# EAGLE design Uni-2.4(prot) (EAGLE 9.6.2)

## Sheet 1 of 4
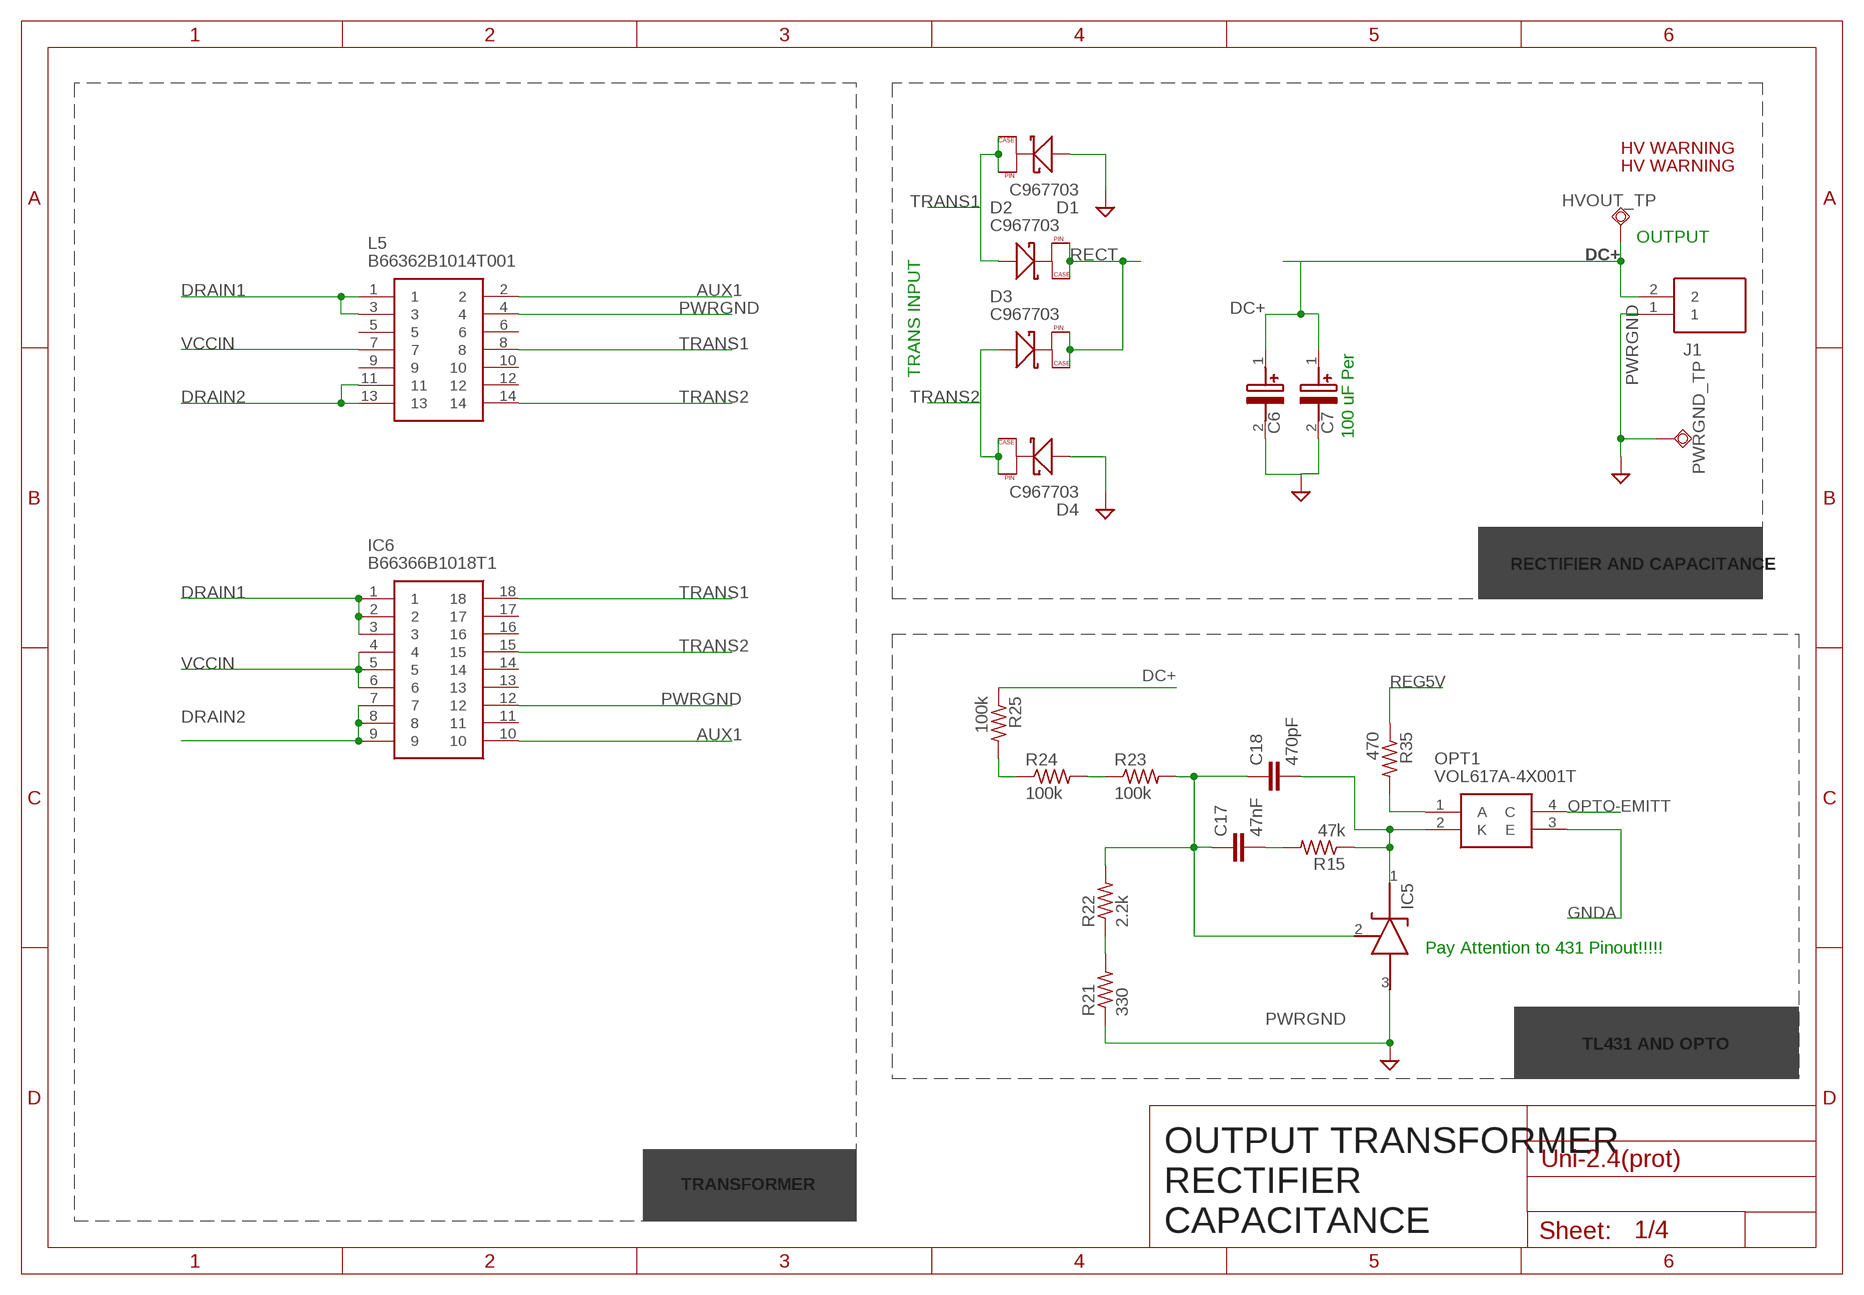
[diagram p0: schematic, sheet 1]

### Parts
C6  400BXW100MEFR18X25  [CAPPRD750W80D1825H2700]
C7  400BXW100MEFR18X25  [CAPPRD750W80D1825H2700]
C17  47nF  C-EUC0603K  [C0603K]
C18  470pF  C-EUC0603K  [C0603K]
D1  C967703  SICDIODE  [TO-252]
D2  C967703  SICDIODE  [TO-252]
D3  C967703  SICDIODE  [TO-252]
D4  C967703  SICDIODE  [TO-252]
HVOUT_TP  TPSQPAD1-13  [P1-13]
IC5  cl431  TL431CL3T  [SOT95P280X145-3N]
IC6  B66366B1018T1  [DIPS3556W80P508L4960H3840Q18N]
J1  TB005-762-02BE  [TB00576202BE]
L5  B66362B1014T001  [B66362B1014T001]
OPT1  VOL617A-4X001T  [SOP254P1015X230-4N]
PWRGND_TP  TPSQPAD1-13  [P1-13]
R15  47k  R-US_R0603  [R0603]
R21  330  R-US_R0805  [R0805]
R22  2.2k  R-US_R0805  [R0805]
R23  100k  R-US_R1206  [R1206]
R24  100k  R-US_R1206  [R1206]
R25  100k  R-US_R1206  [R1206]
R35  470  R-US_R0603  [R0603]
U$3  HV  [PSFBC_ELECTRIC_SHOCK]
U$4  HV  [PSFBC_ELECTRIC_SHOCK]

### Nets
AUX1: IC6.10 L5.2 ; also sheet 3
DC+: C6.1(+) C7.1(+) HVOUT_TP.TP J1.2 R25.1 ; also sheet 2
DRAIN1: IC6.1 IC6.2 IC6.3 L5.1 L5.3 ; also sheet 4
DRAIN2: IC6.7 IC6.8 IC6.9 L5.11 L5.13 ; also sheet 4
GNDA: OPT1.3(E) ; also sheet 3,4
N$1: R24.1 R25.2
N$3: C17.1 C18.1 IC5.2(REF) R22.2 R23.2
N$15: R23.1 R24.2
N$16: R21.2 R22.1
N$18: C18.2 IC5.1(CATHODE) OPT1.2(K) R15.1
N$19: OPT1.1(A) R35.2
N$21: C17.2 R15.2
OPTO-EMITT: OPT1.4(C) ; also sheet 4
PWRGND: C6.2(-) C7.2(-) D1.2(A) D4.2(A) IC5.3(ANODE) IC6.12 J1.1 L5.4 PWRGND_TP.TP R21.1 ; supply symbol labelled GND ; also sheet 2,3
RECT: D2.1(K_1) D2.3(K_2) D3.1(K_1) D3.3(K_2)
REG5V: R35.1 ; also sheet 3
TRANS1: D1.1(K_1) D1.3(K_2) D2.2(A) IC6.18 L5.8
TRANS2: D3.2(A) D4.1(K_1) D4.3(K_2) IC6.15 L5.14
VCCIN: IC6.4 IC6.5 IC6.6 L5.7 ; also sheet 3,4
Unconnected: IC6.11 IC6.13 IC6.14 IC6.16 IC6.17 L5.5 L5.6 L5.9 L5.10 L5.12

### Notes on the sheet
- OUTPUT
- TRANS INPUT
- 100 uF Per
- RECTIFIER AND CAPACITANCE
- Pay Attention to 431 Pinout!!!!!
- TL431 AND OPTO
- TRANSFORMER
- OUTPUT TRANSFORMER
  RECTIFIER
  CAPACITANCE

## Sheet 2 of 4
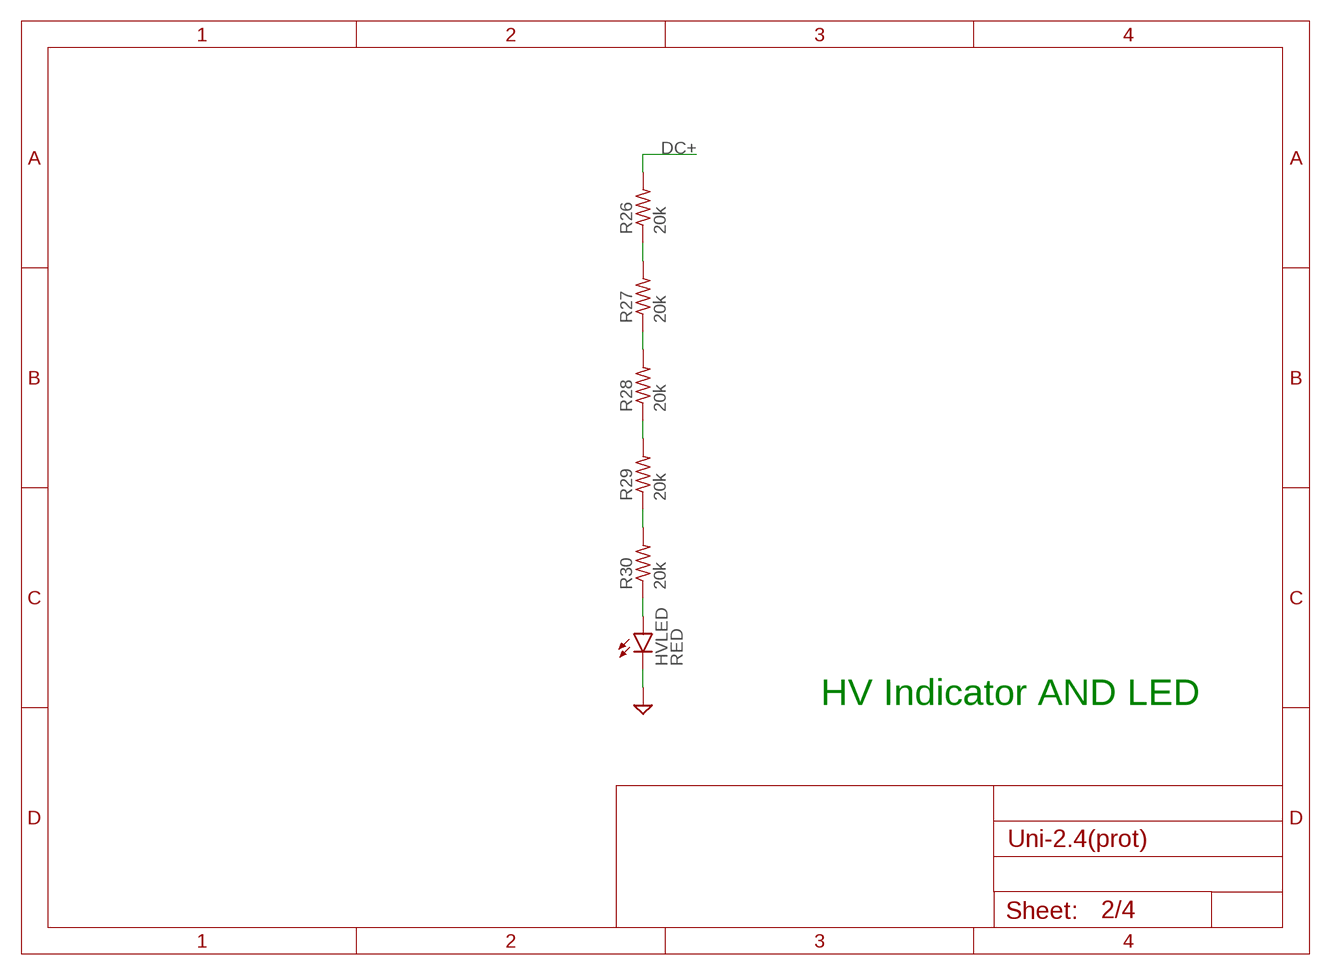
[diagram p1: schematic, sheet 2]

### Parts
HVLED  RED  LEDCHIPLED_0805  [CHIPLED_0805]
R26  20k  R-US_R1206  [R1206]
R27  20k  R-US_R1206  [R1206]
R28  20k  R-US_R1206  [R1206]
R29  20k  R-US_R1206  [R1206]
R30  20k  R-US_R1206  [R1206]

### Nets
DC+: R26.2 ; also sheet 1
N$12: HVLED.A R30.1
N$14: R29.1 R30.2
N$17: R28.1 R29.2
N$24: R27.1 R28.2
N$28: R26.1 R27.2
PWRGND: HVLED.C ; supply symbol labelled GND ; also sheet 1,3

### Notes on the sheet
- HV Indicator AND LED

## Sheet 3 of 4
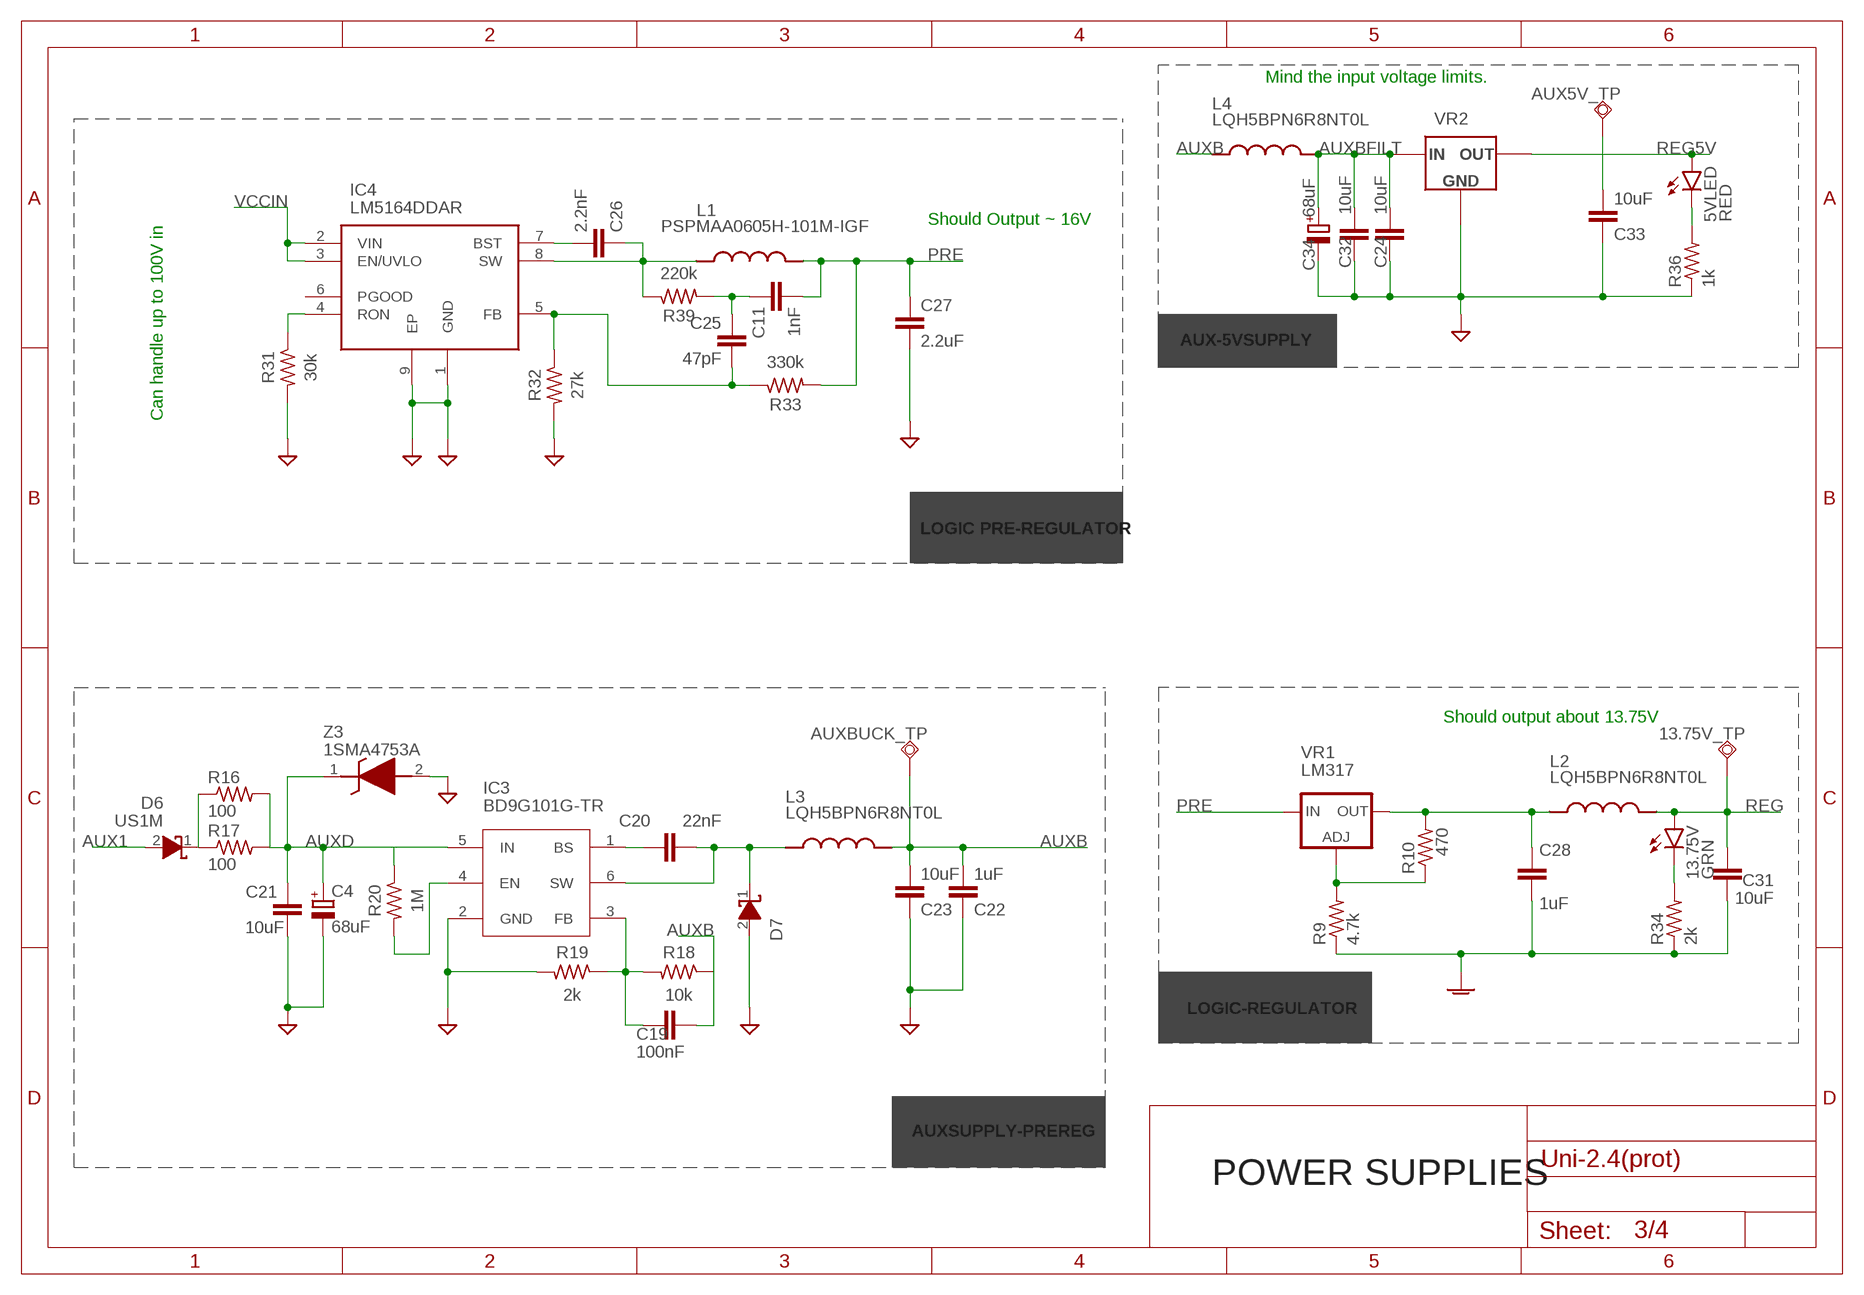
[diagram p2: schematic, sheet 3]

### Parts
5VLED  RED  LEDCHIPLED_0805  [CHIPLED_0805]
13.75V  GRN  LEDCHIPLED_0805  [CHIPLED_0805]
13.75V_TP  TPSQTP18R  [TP18R]
AUX5V_TP  TPSQPAD1-17  [P1-17]
AUXBUCK_TP  TPSQTP13R  [TP13R]
C4  68uF  CPOL-EUUD-8X10  [UD-8X10_NICHICON]
C11  1nF  C-EUC0402  [C0402]
C19  100nF  C-EUC0402K  [C0402K]
C20  22nF  C-EUC0603K  [C0603K]
C21  10uF  C-EUC0805K  [C0805K]
C22  1uF  C-EUC0402  [C0402]
C23  10uF  C-EUC0603K  [C0603K]
C24  10uF  C-EUC0603K  [C0603K]
C25  47pF  C-EUC0402  [C0402]
C26  2.2nF  C-EUC0402  [C0402]
C27  2.2uF  C-EUC0603K  [C0603K]
C28  1uF  C-EUC0603K  [C0603K]
C31  10uF  C-EUC0603K  [C0603K]
C32  10uF  C-EUC0603K  [C0603K]
C33  10uF  C-EUC0603K  [C0603K]
C34  68uF  CPOL-EUUD-8X10  [UD-8X10_NICHICON]
D6  US1M  SCHOTTKY  [DIOM5127X229N]
D7  SCHOTTKY  [DIOM5127X229N]
IC3  BD9G101G-TR  [SOT95P280X145-6N]
IC4  LM5164DDAR  [SOIC127P600X170-9N]
L1  PSPMAA0605H-101M-IGF  [PSPMAA0605H-101M-IGF]
L2  LQH5BPN6R8NT0L  [LQH5BPB100MT0L]
L3  LQH5BPN6R8NT0L  [LQH5BPB100MT0L]
L4  LQH5BPN6R8NT0L  [LQH5BPB100MT0L]
R9  4.7k  R-US_R0603  [R0603]
R10  470  R-US_R0603  [R0603]
R16  100  R-US_R1206  [R1206]
R17  100  R-US_R1206  [R1206]
R18  10k  R-US_R0402  [R0402]
R19  2k  R-US_R0402  [R0402]
R20  1M  R-US_R0402  [R0402]
R31  30k  R-US_R0402  [R0402]
R32  27k  R-US_R0603  [R0603]
R33  330k  R-US_R0402  [R0402]
R34  2k  R-US_R0603  [R0603]
R36  1k  R-US_R0603  [R0603]
R39  220k  R-US_R0603  [R0603]
VR1  LM317  LM317MBDT  [DPACK]
VR2  AP2120N-5.0TRG1  [SOT95P280X145-3N]
Z3  1SMA4753A  1SMA5942BT3G  [DIOM5226X220N]

### Nets
AUX1: D6.2(A) ; also sheet 1
AUXB: AUXBUCK_TP.TP C19.1 C22.2 C23.2 L3.2 L4.1 R18.1
AUXBFILT: C24.2 C32.2 C34.+ L4.2 VR2.3(VIN)
AUXD: C4.+ C21.1 IC3.5(IN) R16.2 R17.2 R20.1 Z3.1(K)
BS2: C20.1 IC3.1(BS)
EN2: IC3.4(EN) R20.2
FB2: C19.2 IC3.3(FB) R18.2 R19.1
GND: C27.2 IC4.1(GND) IC4.9(EP) R31.2 R32.2
GNDA: C28.2 C31.1 R9.1 R34.1 ; also sheet 1,4
N$10: R9.2 R10.1 VR1.1(ADJ)
N$11: IC4.4(RON) R31.1
N$22: 13.75V.C R34.2
N$25: C26.2 IC4.7(BST)
N$26: 5VLED.C R36.2
N$27: D6.1(K) R16.1 R17.1
N$29: C26.1 IC4.8(SW) L1.1 R39.1
N$30: C25.2 IC4.5(FB) R32.1 R33.1
N$31: C28.1 L2.1 R10.2 VR1.4(OUT)
N$32: C11.1 C25.1 R39.2
PRE: C11.2 C27.1 L1.2 R33.2 VR1.3(IN)
PWRGND: C4.- C21.2 C22.1 C23.1 C24.1 C32.1 C33.1 C34.- D7.2(A) IC3.2(GND) R19.2 R36.1 VR2.1(GND) Z3.2(A) ; supply symbol labelled GND ; also sheet 1,2
REG: 13.75V.A 13.75V_TP.TP C31.2 L2.2 ; also sheet 4
REG5V: 5VLED.A AUX5V_TP.TP C33.2 VR2.2(VOUT) ; also sheet 1
SWITCH2: C20.2 D7.1(K) IC3.6(SW) L3.1
VCCIN: IC4.2(VIN) IC4.3(EN/UVLO) ; also sheet 1,4
Unconnected: IC4.6(PGOOD)

### Notes on the sheet
- Mind the input voltage limits.
- Should Output ~ 16V
- AUX-5VSUPPLY
- Can handle up to 100V in
- LOGIC PRE-REGULATOR
- Should output about 13.75V
- LOGIC-REGULATOR
- AUXSUPPLY-PREREG
- POWER SUPPLIES

## Sheet 4 of 4
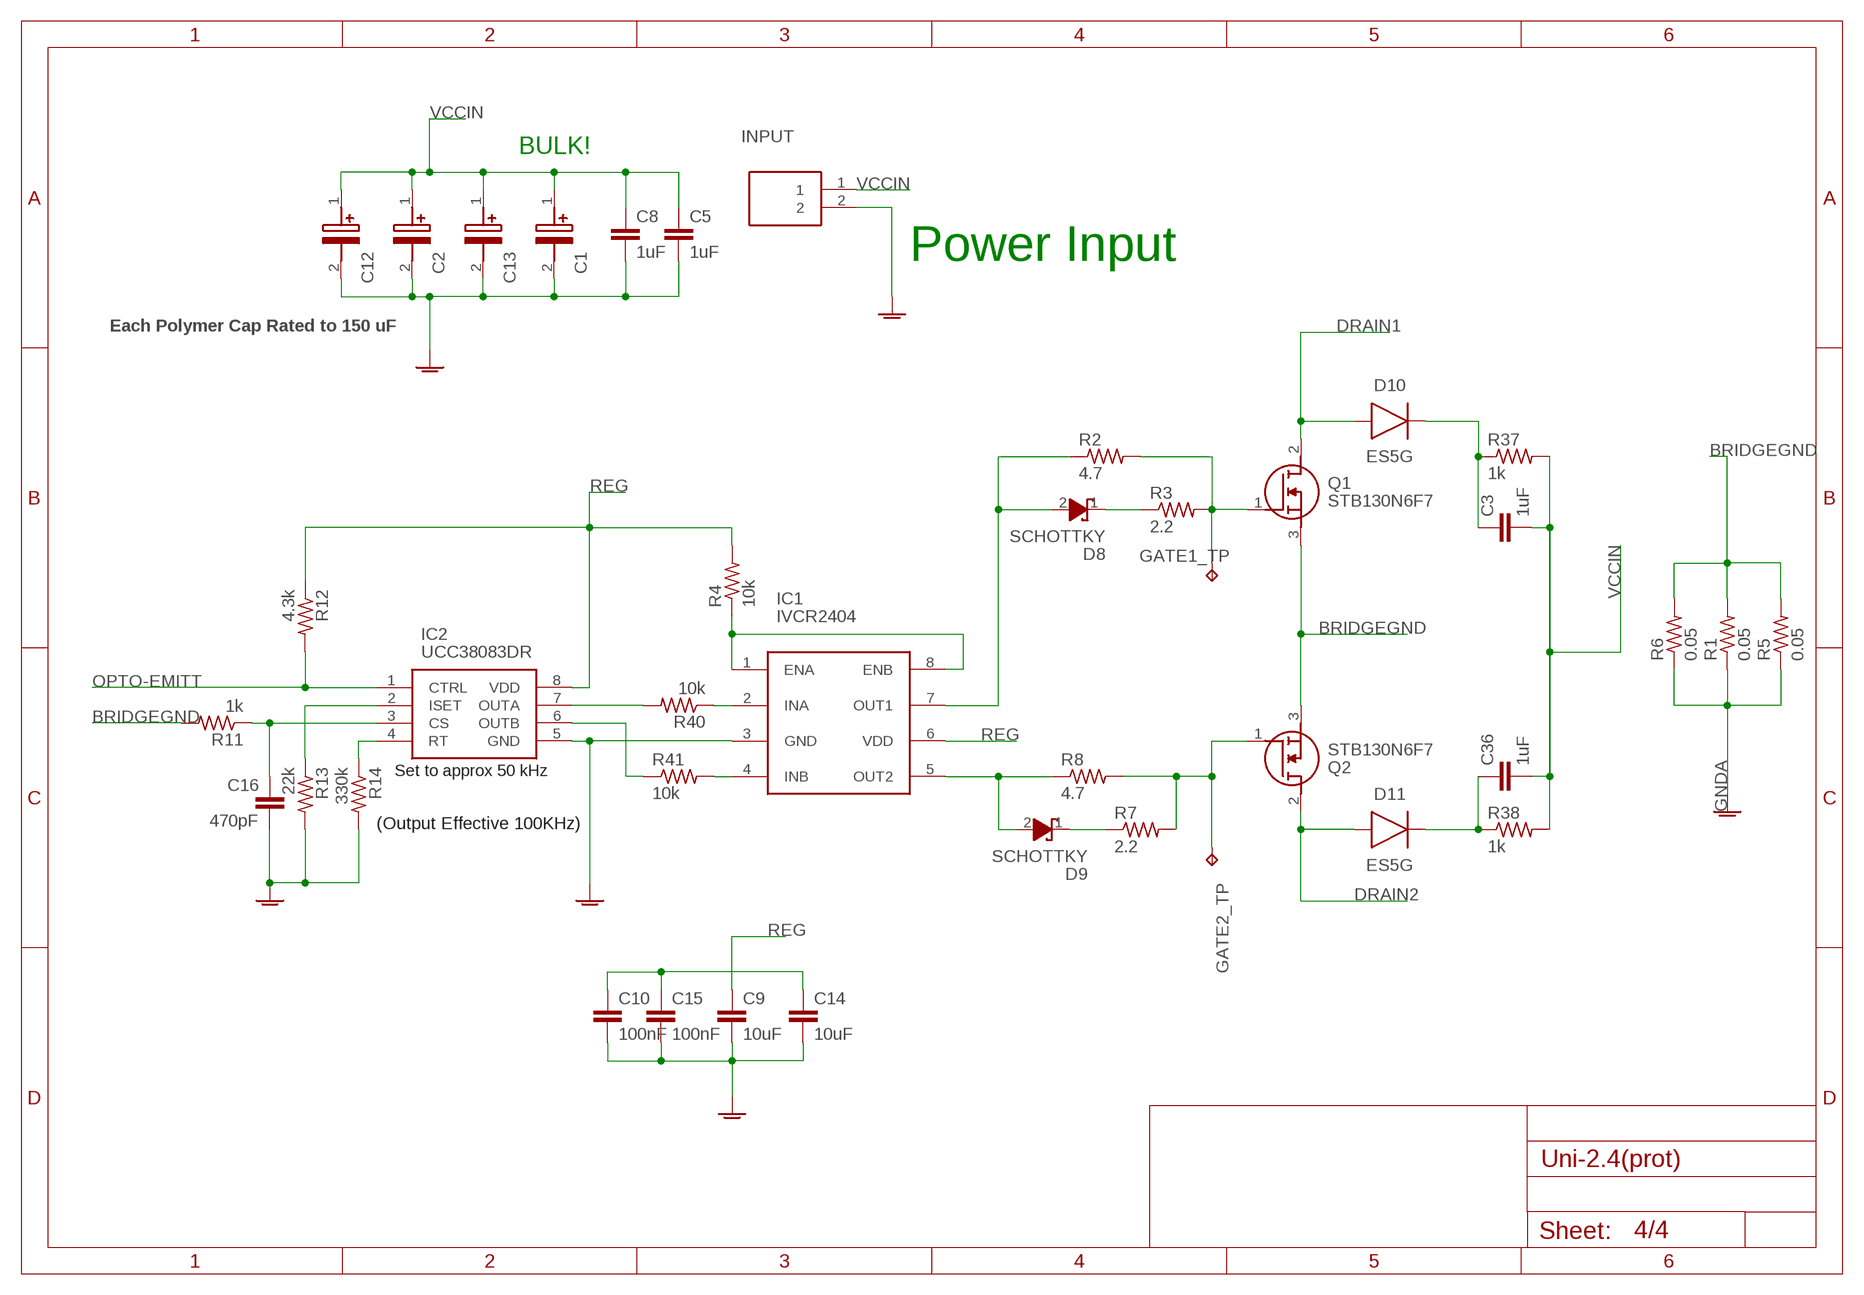
[diagram p3: schematic, sheet 4]

### Parts
C1  OVK151M1VTR-10131  [16SVF1000M]
C2  OVK151M1VTR-10131  [16SVF1000M]
C3  1uF  C-EUC1206K  [C1206K]
C5  1uF  C-EUC0805K  [C0805K]
C8  1uF  C-EUC0805K  [C0805K]
C9  10uF  C-EUC0603K  [C0603K]
C10  100nF  C-EUC0603K  [C0603K]
C12  OVK151M1VTR-10131  [16SVF1000M]
C13  OVK151M1VTR-10131  [16SVF1000M]
C14  10uF  C-EUC0603K  [C0603K]
C15  100nF  C-EUC0603K  [C0603K]
C16  470pF  C-EUC0603K  [C0603K]
C36  1uF  C-EUC1206K  [C1206K]
D8  SCHOTTKY  [DIOM5127X229N]
D9  SCHOTTKY  [DIOM5127X229N]
D10  ES5G  DIODEDO-214AA(SMB)  [DIOM5336X265N]
D11  ES5G  DIODEDO-214AA(SMB)  [DIOM5336X265N]
GATE1_TP  TPTP13R  [TP13R]
GATE2_TP  TPTP13R  [TP13R]
IC1  IVCR2404  MCP14A0304T-E_SN  [SOIC127P600X175-8N]
IC2  UCC38083DR  [SOIC127P600X175-8N]
INPUT  TB005-762-02BE  [TB00576202BE]
Q1  STB130N6F7  [D2PAK]
Q2  STB130N6F7  [D2PAK]
R1  0.05  R-US_R2512  [R2512]
R2  4.7  R-US_R0805  [R0805]
R3  2.2  R-US_R0805  [R0805]
R4  10k  R-US_R0402  [R0402]
R5  0.05  R-US_R2512  [R2512]
R6  0.05  R-US_R2512  [R2512]
R7  2.2  R-US_R0805  [R0805]
R8  4.7  R-US_R0805  [R0805]
R11  1k  R-US_R0603  [R0603]
R12  4.3k  R-US_R0603  [R0603]
R13  22k  R-US_R0603  [R0603]
R14  330k  R-US_R0603  [R0603]
R37  1k  R-US_R2512  [R2512]
R38  1k  R-US_R2512  [R2512]
R40  10k  R-US_R0402  [R0402]
R41  10k  R-US_R0402  [R0402]

### Nets
BRIDGEGND: Q1.3(S) Q2.3(S) R1.2 R5.2 R6.2 R11.2
CS-IN: C16.1 IC2.3(CS) R11.1
DRAIN1: D10.2(A) Q1.2(D) ; also sheet 1
DRAIN2: D11.2(A) Q2.2(D) ; also sheet 1
GNDA: C1.2(-) C2.2(-) C5.2 C8.2 C9.2 C10.2 C12.2(-) C13.2(-) C14.2 C15.2 C16.2 IC1.3(GND) IC2.5(GND) INPUT.2 R1.1 R5.1 R6.1 R13.2 R14.2 ; also sheet 1,3
N$2: IC1.2(INA) R40.1
N$4: D8.1(K) R3.1
N$5: IC1.4(INB) R41.2
N$6: IC1.1(ENA) IC1.8(ENB) R4.1
N$7: D8.2(A) IC1.7(OUT1) R2.1
N$8: D9.2(A) IC1.5(OUT2) R8.1
N$9: D9.1(K) R7.1
N$13: IC2.2(ISET) R13.1
N$20: C3.1 D10.1(C) R37.1
N$23: C36.1 D11.1(C) R38.1
N$33: IC2.6(OUTB) R41.1
N$34: IC2.7(OUTA) R40.2
OPTO-EMITT: IC2.1(CTRL) R12.2 ; also sheet 1
Q1G: GATE1_TP.TP Q1.1(G) R2.2 R3.2
Q2G: GATE2_TP.TP Q2.1(G) R7.2 R8.2
REG: C9.1 C10.1 C14.1 C15.1 IC1.6(VDD) IC2.8(VDD) R4.2 R12.1 ; also sheet 3
RT: IC2.4(RT) R14.1
VCCIN: C1.1(+) C2.1(+) C3.2 C5.1 C8.1 C12.1(+) C13.1(+) C36.2 INPUT.1 R37.2 R38.2 ; also sheet 1,3

### Notes on the sheet
- BULK!
- Power Input
- Each Polymer Cap Rated to 150 uF
- Set to approx 50 kHz
- (Output Effective 100KHz)

## Library data of the parts
5VLED 13.75V = led:LED: LED OSRAM: - CHIPLED LG R971, LG N971, LY N971, LG Q971, LY Q971, LO R971, LY R971 LH N974, LH R974 LS Q976, LO Q976, LY Q976 LO Q996 - Hyper CHIPLED LW Q18S LB Q993, LB Q99A, LB R99A - SideLED LS A670, LO A670, LY A670, LG A670, LP A670 LB A673, LV A673, LT A673, LW A673 LH A674 LY A675 LS A676, LA A676, LO A676, LY A676, LW A676 LS A679, LY A679, LG A679 - Hyper Micro SIDELED® LS Y876, LA Y876, LO Y876, LY Y876 LT Y87S - SmartLED LW L88C, LW L88S LB L89C, LB L89S, LG L890 LS L89K, LO L89K, LY L89K LS L896, LA L896, LO L896, LY L896 - TOPLED LS T670, LO T670, LY T670, LG T670, LP T670 LSG T670, LSP T670, LSY T670, LOP T670, LYG T670 LG T671, LOG T671, LSG T671 LB T673, LV T673, LT T673, LW T673 LH T674 LS T676, LA T676, LO T676, LY T676, LB T676, LH T676, LSB T676, LW T676 LB T67C, LV T67C, LT T67C, LS T67K, LO T67K, LY T67K, LW E67C LS E67B, LA E67B, LO E67B, LY E67B, LB E67C, LV E67C, LT E67C LW T67C LS T679, LY T679, LG T679 LS T770, LO T770, LY T770, LG T770, LP T770 LB T773, LV T773, LT T773, LW T773 LH T774 LS E675, LA E675, LY E675, LS T675 LS T776, LA T776, LO T776, LY T776, LB T776 LHGB T686 LT T68C, LB T68C - Hyper Mini TOPLED® LB M676 - Mini TOPLED Santana® LG M470 LS M47K, LO M47K, LY M47K Source: http://www.osram.convergy.de LUXEON: - LUMILED® LXK2-PW12-R00, LXK2-PW12-S00, LXK2-PW14-U00, LXK2-PW14-V00 LXK2-PM12-R00, LXK2-PM12-S00, LXK2-PM14-U00 LXK2-PE12-Q00, LXK2-PE12-R00, LXK2-PE12-S00, LXK2-PE14-T00, LXK2-PE14-U00 LXK2-PB12-K00, LXK2-PB12-L00, LXK2-PB12-M00, LXK2-PB14-N00, LXK2-PB14-P00, LXK2-PB14-Q00 LXK2-PR12-L00, LXK2-PR12-M00, LXK2-PR14-Q00, LXK2-PR14-R00 LXK2-PD12-Q00, LXK2-PD12-R00, LXK2-PD12-S00 LXK2-PH12-R00, LXK2-PH12-S00 LXK2-PL12-P00, LXK2-PL12-Q00, LXK2-PL12-R00 Source: www.luxeon.com KINGBRIGHT: KA-3528ASYC Source: www.kingbright.com; LCSC_PART: C72043
13.75V_TP AUX5V_TP AUXBUCK_TP HVOUT_TP PWRGND_TP = testpad:TPSQ: Test pad
C1 C2 C12 C13 = SamacSys_Parts:OVK151M1VTR-1013: OVK151M1VTR-1013
C3 C17 C18 C21 C33 C36 = rcl:C-EU: CAPACITOR, European symbol; SPICEPREFIX: C
C4 C34 = rcl:CPOL-EU: POLARIZED CAPACITOR, European symbol; LCSC_PART: C249948; SPICEPREFIX: C
C5 C8-C11 C14 C15 C22-C27 C32 = rcl:C-EU: CAPACITOR, European symbol; LCSC_PART: C440198; SPICEPREFIX: C
C6 C7 = SamacSys_Parts:400BXW100MEFR18X25: Aluminum Electrolytic Capacitors - Radial Leaded LONG LIFE ELECTROLYTIC CAPACITORS Source: Datasheet <http://www.rubycon.co.jp/en/catalog/e_pdfs/aluminum/e_BXW.pdf>; DESCRIPTION: Aluminum Electrolytic Capacitors - Radial Leaded LONG LIFE ELECTROLYTIC CAPACITORS; HEIGHT: 27mm; MANUFACTURER_NAME: Rubycon; MANUFACTURER_PART_NUMBER: 400BXW100MEFR18X25
C16 = rcl:C-EU: CAPACITOR, European symbol; LCSC_PART: C1620; SPICEPREFIX: C
C19 = rcl:C-EU: CAPACITOR, European symbol; LCSC_PART: C1546; SPICEPREFIX: C
C20 = rcl:C-EU: CAPACITOR, European symbol; LCSC_PART: C14663; SPICEPREFIX: C
C28 C31 = rcl:C-EU: CAPACITOR, European symbol; LCSC_PART: C440198
D1-D4 = SamacSys_Parts:SICDIODE: SiC TO-252 Diode
D6 D8 D9 = SamacSys_Parts:SCHOTTKY: Schottky Diodes & Rectifiers 60V Sctky Bar Rectfr SMA (DO-214AC) Source: Datasheet <https://www.arrow.com/en/products/ss16he3-bh/vishay>; DESCRIPTION: Schottky Diodes & Rectifiers 60V Sctky Bar Rectfr SMA (DO-214AC); HEIGHT: 2.29mm; MANUFACTURER_NAME: Vishay; MANUFACTURER_PART_NUMBER: SS16HE3_B/H; MOUSER_PART_NUMBER: 78-SS16HE3_B/H; MOUSER_PRICE-STOCK: https://www.mouser.co.uk/ProductDetail/Vishay-General-Semiconductor/SS16HE3_B-H?qs=MLItCLRbWsyJmaJ87KUvIw%3D%3D
D7 = SamacSys_Parts:SCHOTTKY: Schottky Diodes & Rectifiers 60V Sctky Bar Rectfr SMA (DO-214AC) Source: Datasheet <https://www.arrow.com/en/products/ss16he3-bh/vishay>; DESCRIPTION: Schottky Diodes & Rectifiers 60V Sctky Bar Rectfr SMA (DO-214AC); HEIGHT: 2.29mm; LCSC_PART: C22452; MANUFACTURER_NAME: Vishay; MANUFACTURER_PART_NUMBER: SS16HE3_B/H; MOUSER_PART_NUMBER: 78-SS16HE3_B/H; MOUSER_PRICE-STOCK: https://www.mouser.co.uk/ProductDetail/Vishay-General-Semiconductor/SS16HE3_B-H?qs=MLItCLRbWsyJmaJ87KUvIw%3D%3D
D10 = Diode:DIODE: Diode Rectifier - Generic; CATEGORY: Diode; LCSC_PART: C128705; SUB-CATEGORY: Rectifier; VALUE: DIODE
D11 = Diode:DIODE: Diode Rectifier - Generic; CATEGORY: Diode; SUB-CATEGORY: Rectifier; VALUE: DIODE
GATE1_TP GATE2_TP = testpad:TP: Test pad
HVLED = led:LED: LED OSRAM: - CHIPLED LG R971, LG N971, LY N971, LG Q971, LY Q971, LO R971, LY R971 LH N974, LH R974 LS Q976, LO Q976, LY Q976 LO Q996 - Hyper CHIPLED LW Q18S LB Q993, LB Q99A, LB R99A - SideLED LS A670, LO A670, LY A670, LG A670, LP A670 LB A673, LV A673, LT A673, LW A673 LH A674 LY A675 LS A676, LA A676, LO A676, LY A676, LW A676 LS A679, LY A679, LG A679 - Hyper Micro SIDELED® LS Y876, LA Y876, LO Y876, LY Y876 LT Y87S - SmartLED LW L88C, LW L88S LB L89C, LB L89S, LG L890 LS L89K, LO L89K, LY L89K LS L896, LA L896, LO L896, LY L896 - TOPLED LS T670, LO T670, LY T670, LG T670, LP T670 LSG T670, LSP T670, LSY T670, LOP T670, LYG T670 LG T671, LOG T671, LSG T671 LB T673, LV T673, LT T673, LW T673 LH T674 LS T676, LA T676, LO T676, LY T676, LB T676, LH T676, LSB T676, LW T676 LB T67C, LV T67C, LT T67C, LS T67K, LO T67K, LY T67K, LW E67C LS E67B, LA E67B, LO E67B, LY E67B, LB E67C, LV E67C, LT E67C LW T67C LS T679, LY T679, LG T679 LS T770, LO T770, LY T770, LG T770, LP T770 LB T773, LV T773, LT T773, LW T773 LH T774 LS E675, LA E675, LY E675, LS T675 LS T776, LA T776, LO T776, LY T776, LB T776 LHGB T686 LT T68C, LB T68C - Hyper Mini TOPLED® LB M676 - Mini TOPLED Santana® LG M470 LS M47K, LO M47K, LY M47K Source: http://www.osram.convergy.de LUXEON: - LUMILED® LXK2-PW12-R00, LXK2-PW12-S00, LXK2-PW14-U00, LXK2-PW14-V00 LXK2-PM12-R00, LXK2-PM12-S00, LXK2-PM14-U00 LXK2-PE12-Q00, LXK2-PE12-R00, LXK2-PE12-S00, LXK2-PE14-T00, LXK2-PE14-U00 LXK2-PB12-K00, LXK2-PB12-L00, LXK2-PB12-M00, LXK2-PB14-N00, LXK2-PB14-P00, LXK2-PB14-Q00 LXK2-PR12-L00, LXK2-PR12-M00, LXK2-PR14-Q00, LXK2-PR14-R00 LXK2-PD12-Q00, LXK2-PD12-R00, LXK2-PD12-S00 LXK2-PH12-R00, LXK2-PH12-S00 LXK2-PL12-P00, LXK2-PL12-Q00, LXK2-PL12-R00 Source: www.luxeon.com KINGBRIGHT: KA-3528ASYC Source: www.kingbright.com
IC1 = SamacSys_Parts:MCP14A0304T-E_SN: Microchip Technology MCP14A0304T-E/SN Dual Low Side MOSFET Power Driver, 3A 8-Pin, SOIC Source: Datasheet <http://www.microchip.com/mymicrochip/filehandler.aspx?ddocname=en606629>; DESCRIPTION: Microchip Technology MCP14A0304T-E/SN Dual Low Side MOSFET Power Driver, 3A 8-Pin, SOIC; HEIGHT: 1.75mm; LCSC_PART: C2924635; MANUFACTURER_NAME: Microchip; MANUFACTURER_PART_NUMBER: MCP14A0304T-E/SN; MOUSER_PART_NUMBER: 579-MCP14A0304T-E/SN; MOUSER_PRICE-STOCK: https://www.mouser.co.uk/ProductDetail/Microchip-Technology/MCP14A0304T-E-SN?qs=w%2Fv1CP2dgqqqWUCaoFqV0w%3D%3D
IC2 = SamacSys_Parts:UCC38083DR: Current Mode Push-Pull PWM With Programmable Slope Compensation Source: Datasheet <http://www.ti.com/lit/gpn/ucc38083>; DESCRIPTION: Current Mode Push-Pull PWM With Programmable Slope Compensation; HEIGHT: 1.75mm; MANUFACTURER_NAME: Texas Instruments; MANUFACTURER_PART_NUMBER: UCC38083DR; MOUSER_PART_NUMBER: 595-UCC38083DR; MOUSER_PRICE-STOCK: https://www.mouser.co.uk/ProductDetail/Texas-Instruments/UCC38083DR/?qs=zqbRmZ%252BfZD9Rvt3ie7yhvg%3D%3D
IC3 = SamacSys_Parts:BD9G101G-TR: Has FB voltage of 0.75V! Operates at 1.5 MHz. No PFM.; LCSC_PART: C97643
IC4 = SamacSys_Parts:LM5164DDAR: Texas Instruments 6-V to 100-V Input, 1-A Synchronous Buck DC-DC Converter With Ultra-Low IQ 8-SO PowerPAD -40 to 150 Source: Datasheet <http://www.ti.com/lit/ds/symlink/lm5164.pdf>; DESCRIPTION: Texas Instruments 6-V to 100-V Input, 1-A Synchronous Buck DC-DC Converter With Ultra-Low IQ 8-SO PowerPAD -40 to 150; HEIGHT: 1.7mm; MANUFACTURER_NAME: Texas Instruments; MANUFACTURER_PART_NUMBER: LM5164DDAR; MOUSER_PART_NUMBER: 595-LM5164DDAR; MOUSER_PRICE-STOCK: https://www.mouser.co.uk/ProductDetail/Texas-Instruments/LM5164DDAR?qs=PqoDHHvF64%2F0M%252BK9zcb2mw%3D%3D
IC5 = SamacSys_Parts:TL431CL3T: Adjustable micropower shunt voltage reference Source: Datasheet <https://www.st.com/resource/en/datasheet/tl431.pdf>; DESCRIPTION: Adjustable micropower shunt voltage reference; HEIGHT: 1.12mm; MANUFACTURER_NAME: STMicroelectronics; MANUFACTURER_PART_NUMBER: TL431CL3T; MOUSER_PART_NUMBER: 511-TL431CL3T; MOUSER_PRICE-STOCK: https://www.mouser.co.uk/ProductDetail/STMicroelectronics/TL431CL3T?qs=L6eUzyzWLAsU2SYO1NdhdA%3D%3D
IC6 = SamacSys_Parts:B66366B1018T1: Ferrite Cores & Accessories COIL FORMER VALOX 420 SEO Source: Datasheet <https://componentsearchengine.com/Datasheets/1/B66366B1018T1.pdf>; DESCRIPTION: Ferrite Cores & Accessories COIL FORMER VALOX 420 SEO; HEIGHT: 38.4mm; MANUFACTURER_NAME: TDK; MANUFACTURER_PART_NUMBER: B66366B1018T1; MOUSER_PART_NUMBER: 871-B66366B1018T1; MOUSER_PRICE-STOCK: https://www.mouser.co.uk/ProductDetail/EPCOS-TDK/B66366B1018T1?qs=fWY6Jreybtk%2F8sjb6uin%252BA%3D%3D
INPUT J1 = SamacSys_Parts:TB005-762-02BE: Fixed Terminal Blocks screw type, 7.62 , horizontal, 2 poles, CUI Blue, slotted screw, PCB mount Source: Datasheet <https://componentsearchengine.com/Datasheets/1/TB005-762-02BE.pdf>; DESCRIPTION: Fixed Terminal Blocks screw type, 7.62 , horizontal, 2 poles, CUI Blue, slotted screw, PCB mount; HEIGHT: 21.7mm; MANUFACTURER_NAME: CUI Inc.; MANUFACTURER_PART_NUMBER: TB005-762-02BE; MOUSER_PART_NUMBER: 490-TB005-762-02BE; MOUSER_PRICE-STOCK: https://www.mouser.co.uk/ProductDetail/CUI-Devices/TB005-762-02BE?qs=vLWxofP3U2zXv1H2wuShow%3D%3D
L1 = SamacSys_Parts:PSPMAA0605H-101M-IGF; LCSC_PART: C2983096
L2-L4 = SamacSys_Parts:LQH5BPN6R8NT0L: MURATA - LQH5BPN6R8NT0L - INDUCTOR, 6.8UH, +/-30%, POWER Source: Datasheet <https://psearch.en.murata.com/inductor/product/LQH5BPN6R8NT0#.html>; DESCRIPTION: MURATA - LQH5BPN6R8NT0L - INDUCTOR, 6.8UH, +/-30%, POWER; HEIGHT: 2.2mm; MANUFACTURER_NAME: Murata Electronics; MANUFACTURER_PART_NUMBER: LQH5BPN6R8NT0L; MOUSER_PART_NUMBER: 81-LQH5BPN6R8NT0L0L; MOUSER_PRICE-STOCK: https://www.mouser.co.uk/ProductDetail/Murata-Electronics/LQH5BPN6R8NT0L?qs=3ZwS9AhGA%2F4N8axqd87eRQ%3D%3D
L5 = SamacSys_Parts:B66362B1014T001: Ferrite Accessories, E Cores Accessories(EFD/ER/ETD), Coil former (ETD 34/17/11) Source: Datasheet <https://product.tdk.com/system/files/dam/doc/product/ferrite/ferrite/ferrite-acc/data_sheet/80/db/fer/etd_34_17_11.pdf>; DESCRIPTION: Ferrite Accessories, E Cores Accessories(EFD/ER/ETD), Coil former (ETD 34/17/11); HEIGHT: 33.1mm; MANUFACTURER_NAME: TDK; MANUFACTURER_PART_NUMBER: B66362B1014T001; MOUSER_PART_NUMBER: 871-B66362B1014T001; MOUSER_PRICE-STOCK: https://www.mouser.co.uk/ProductDetail/EPCOS-TDK/B66362B1014T001?qs=w5o0Loj0u7M9FVK%2Ff7P38g%3D%3D
OPT1 = SamacSys_Parts:VOL617A-4X001T: Vishay VOL617A-4X001T DC Input Phototransistor Output Optocoupler, Surface Mount, 4-Pin LSOP Source: Datasheet <https://www.vishay.com/docs/82424/vol617a.pdf>; DESCRIPTION: Vishay VOL617A-4X001T DC Input Phototransistor Output Optocoupler, Surface Mount, 4-Pin LSOP; HEIGHT: 2.3mm; MANUFACTURER_NAME: Vishay; MANUFACTURER_PART_NUMBER: VOL617A-4X001T; MOUSER_PART_NUMBER: 78-VOL617A-4X001T; MOUSER_PRICE-STOCK: https://www.mouser.co.uk/ProductDetail/Vishay-Semiconductors/VOL617A-4X001T?qs=s4XK1XdnRilEoTFGQUoymA%3D%3D
Q1 Q2 = SamacSys_Parts:STB130N6F7
R1-R8 R15-R17 R21-R30 R35 R37 R38 = rcl:R-US_: RESISTOR, American symbol; SPICEPREFIX: R
R9 R10 R12 R34 R36 = rcl:R-US_: RESISTOR, American symbol; LCSC_PART: C22975; SPICEPREFIX: R
R11 R40 R41 = rcl:R-US_: RESISTOR, American symbol; LCSC_PART: C21190; SPICEPREFIX: R
R13 = rcl:R-US_: RESISTOR, American symbol; LCSC_PART: C31850; SPICEPREFIX: R
R14 = rcl:R-US_: RESISTOR, American symbol; LCSC_PART: C25811; SPICEPREFIX: R
R18 R19 = rcl:R-US_: RESISTOR, American symbol; LCSC_PART: C25779; SPICEPREFIX: R
R20 R31-R33 R39 = rcl:R-US_: RESISTOR, American symbol; LCSC_PART: C25741; SPICEPREFIX: R
U$3 U$4 = RMP - HALF BRIDGE 0.0.1:HV
VR1 = v-reg:LM317?*: 500 mA Adjustable Output Positive Voltage Regulator Source: http://www.onsemi.co.jp .. LM317M-D.PDF
VR2 = SamacSys_Parts:AP2120N-5.0TRG1: IC REG LINEAR 5V 150MA SOT23 Source: Datasheet; DESCRIPTION: IC REG LINEAR 5V 150MA SOT23; HEIGHT: 1.2mm; MANUFACTURER_NAME: Diodes Inc.; MANUFACTURER_PART_NUMBER: AP2120N-5.0TRG1; MOUSER_PART_NUMBER: 621-AP2120N-5.0TRG1; MOUSER_PRICE-STOCK: https://www.mouser.co.uk/ProductDetail/Diodes-Incorporated/AP2120N-50TRG1?qs=M%2FOdCRO8QQ3JQu49DdtyIA%3D%3D
Z3 = SamacSys_Parts:1SMA5942BT3G: ON Semiconductor 1SMA5942BT3G Zener Diode, 51V 5% 1.5 W SMT 2-Pin SMA Source: Datasheet <http://www.onsemi.com/pub/Collateral/1SMA5913BT3-D.PDF>; DESCRIPTION: ON Semiconductor 1SMA5942BT3G Zener Diode, 51V 5% 1.5 W SMT 2-Pin SMA; HEIGHT: 2.2mm; LCSC_PART: C362284; MANUFACTURER_NAME: onsemi; MANUFACTURER_PART_NUMBER: 1SMA5942BT3G; MOUSER_PART_NUMBER: 863-1SMA5942BT3G; MOUSER_PRICE-STOCK: https://www.mouser.co.uk/ProductDetail/ON-Semiconductor/1SMA5942BT3G?qs=y2kkmE52mdPrQGqg%252Bfz9yg%3D%3D

## Board
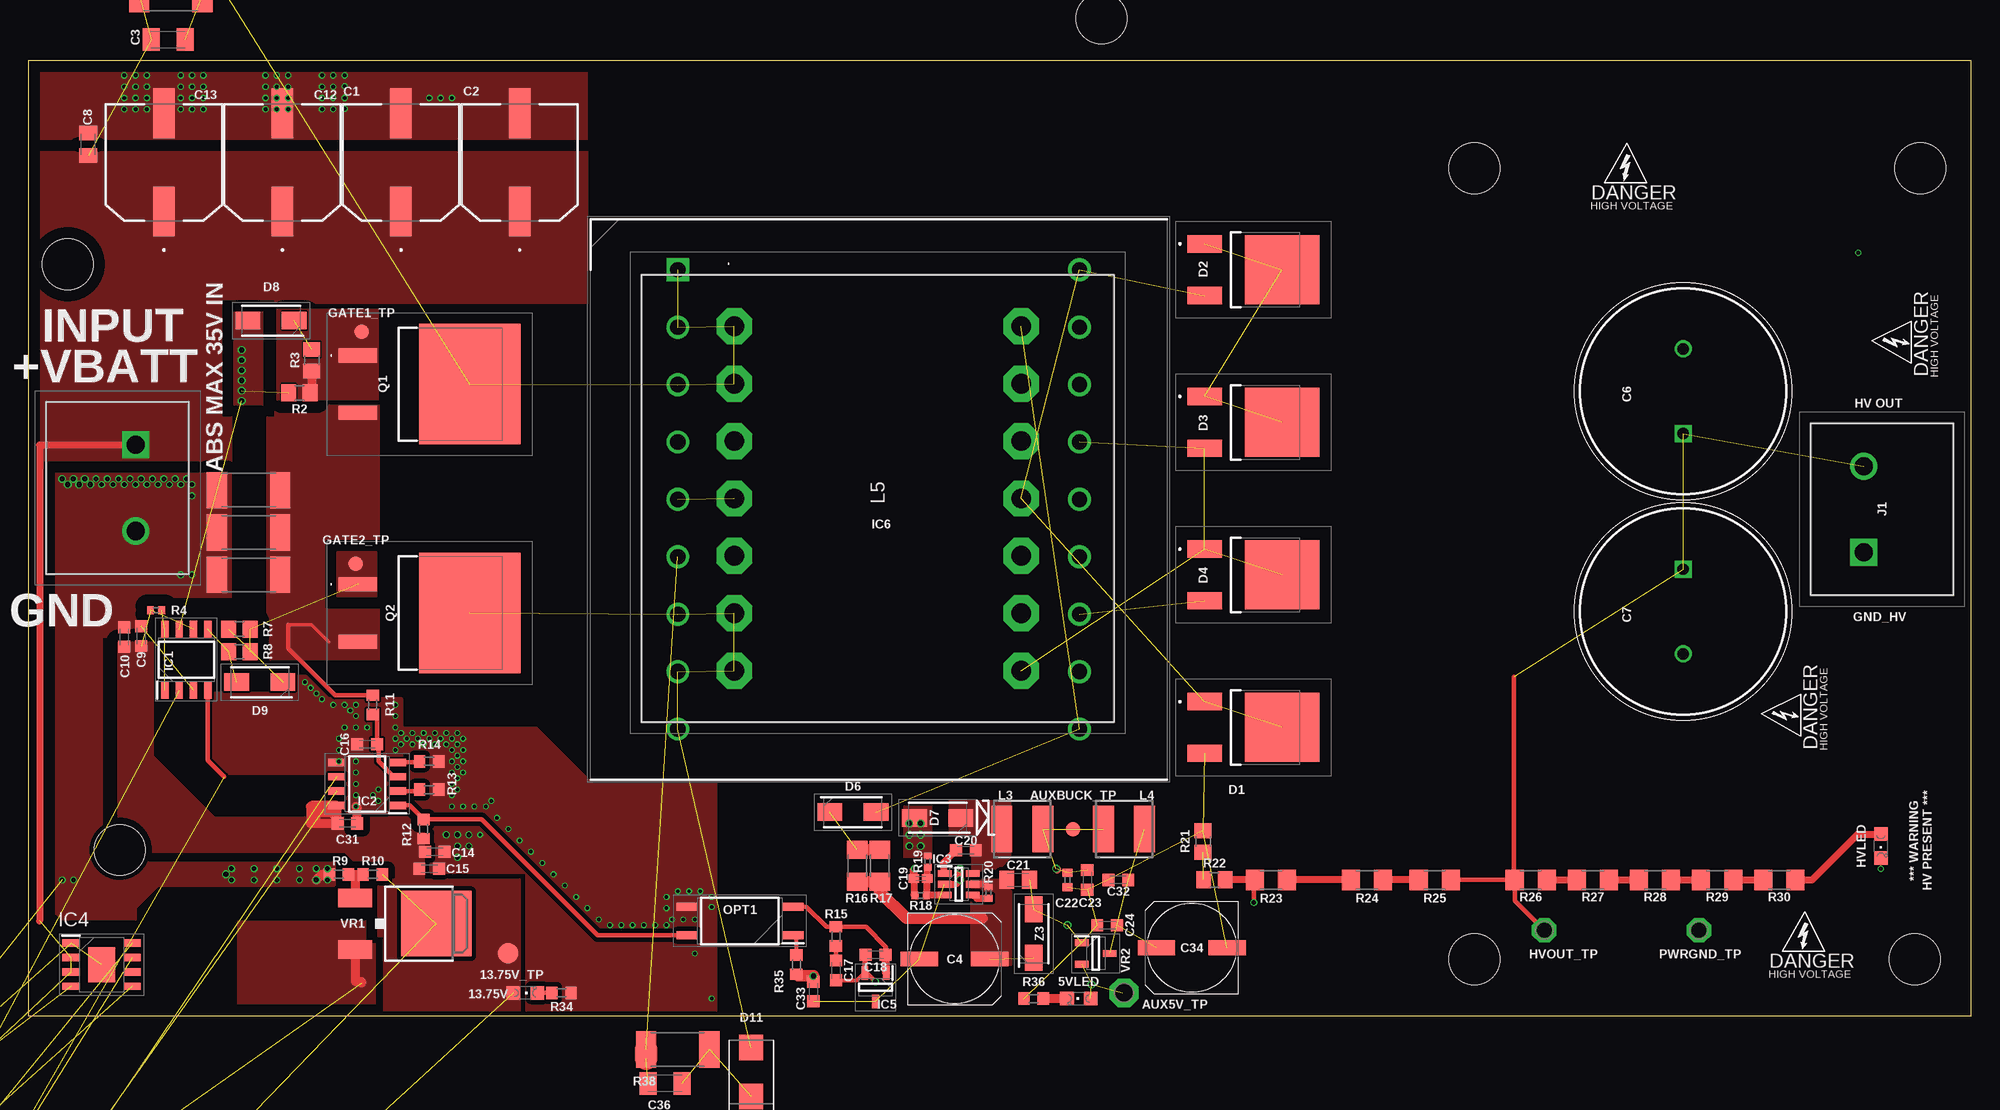
[diagram p4: board, top side]
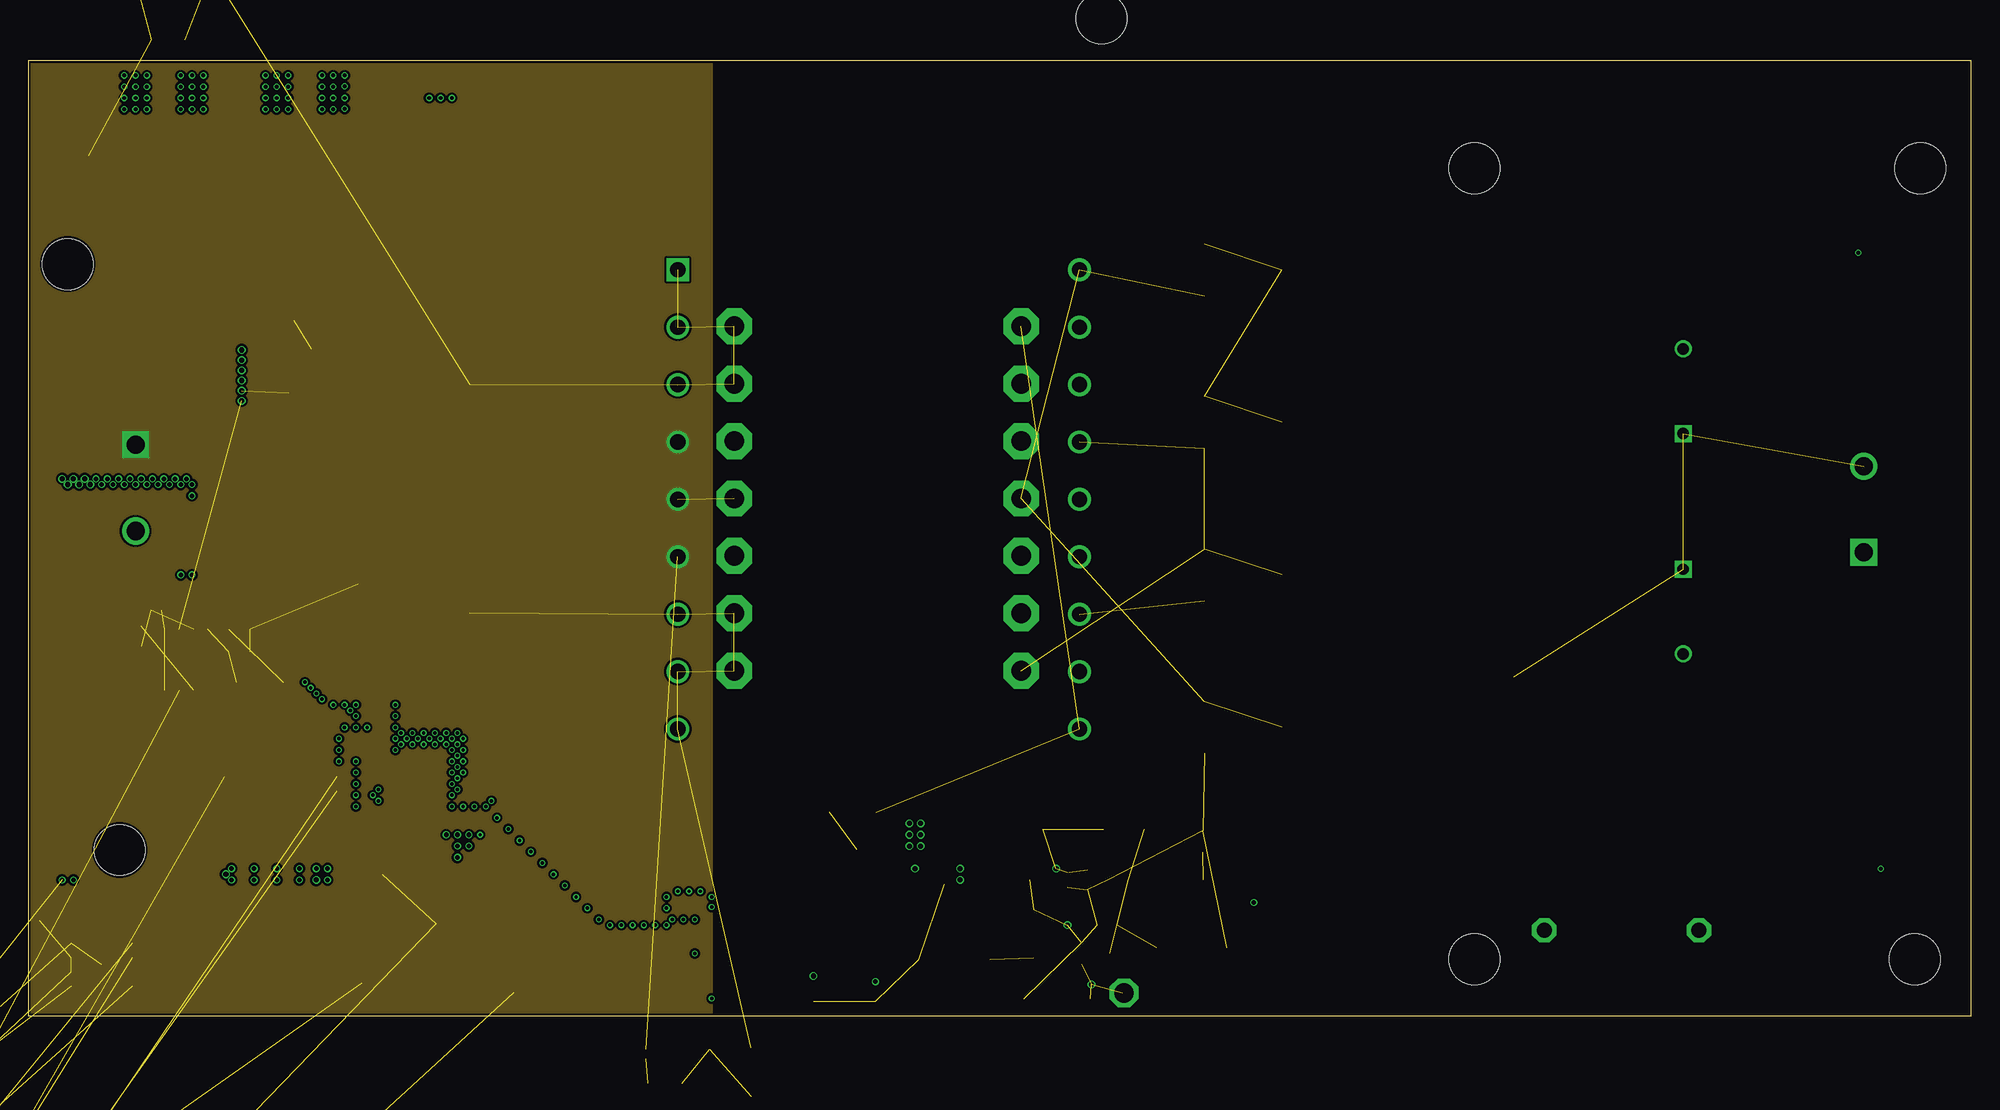
[diagram p5: board, inner layer Route2]
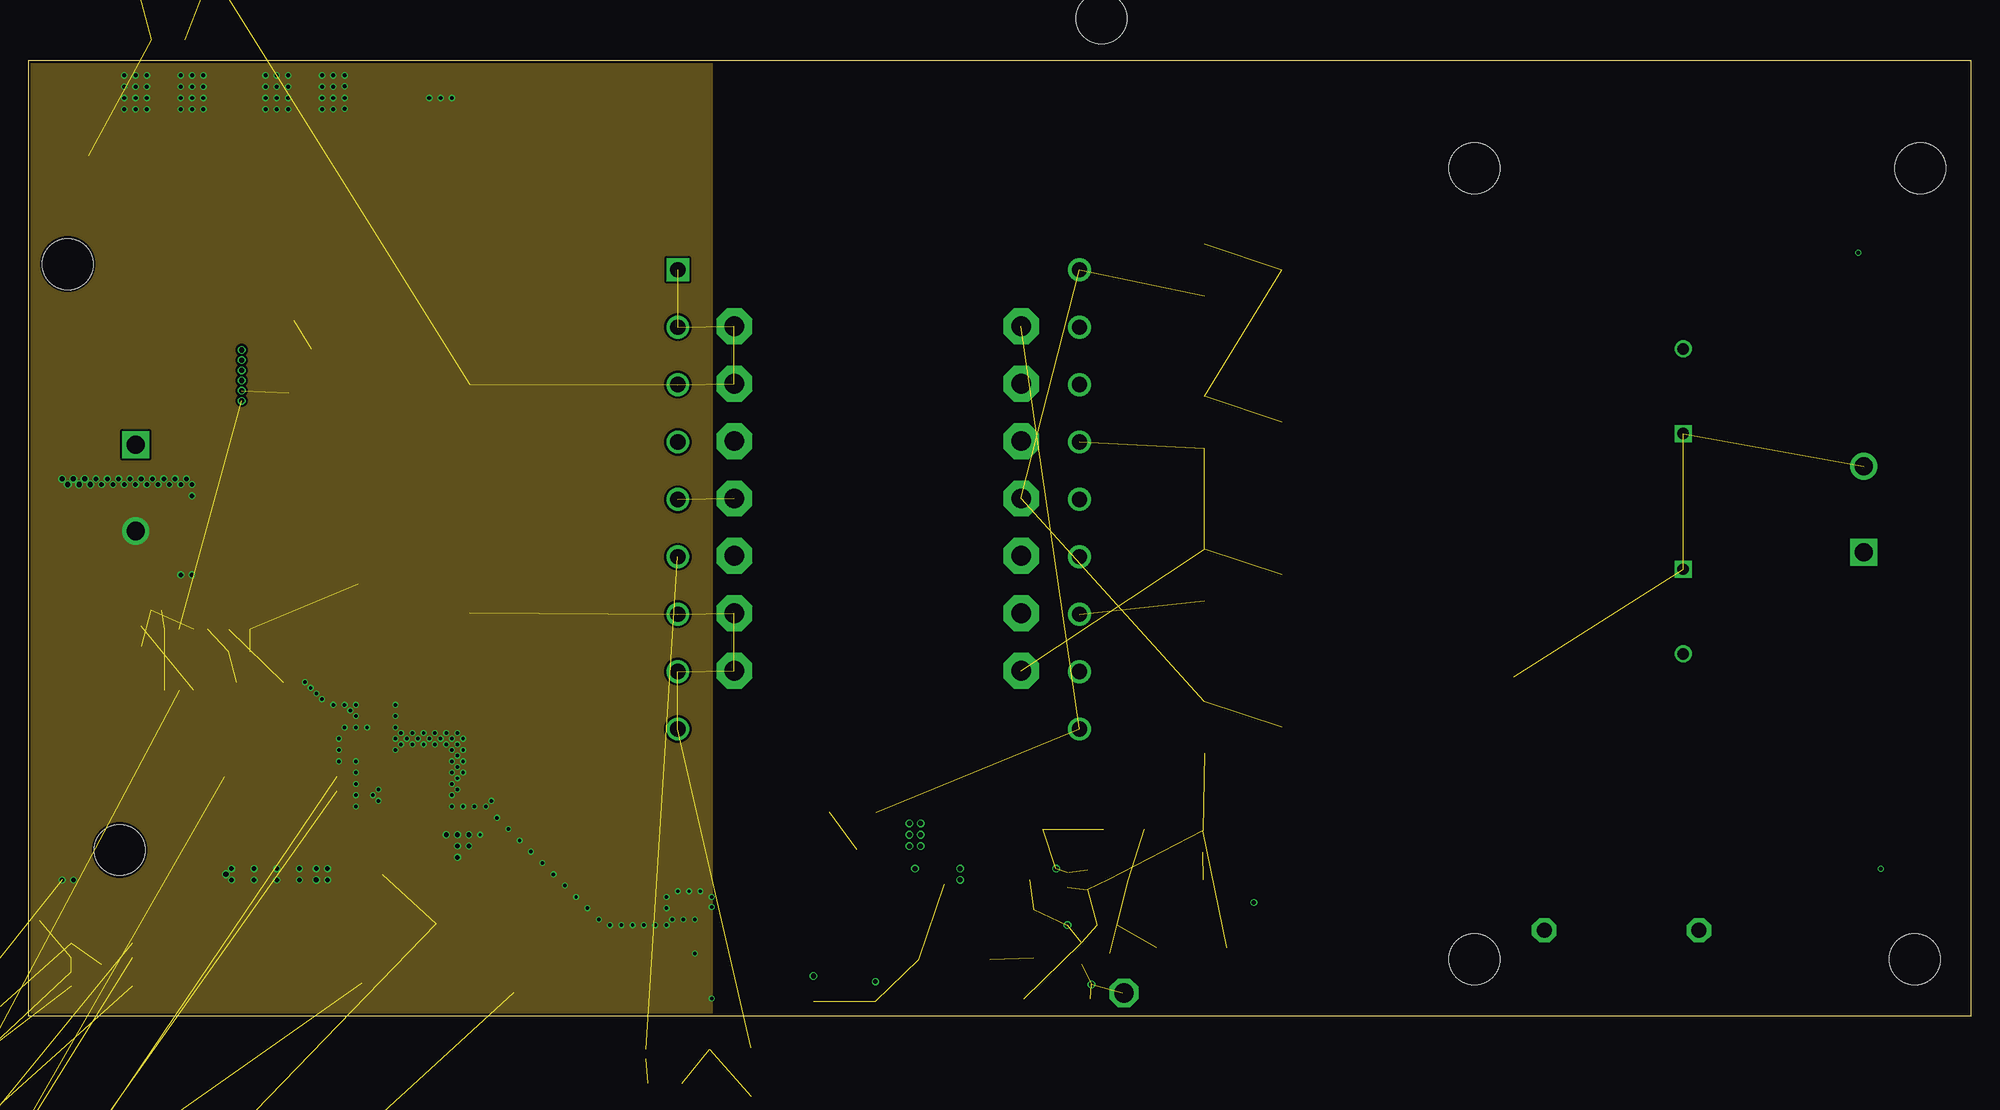
[diagram p6: board, inner layer Route15]
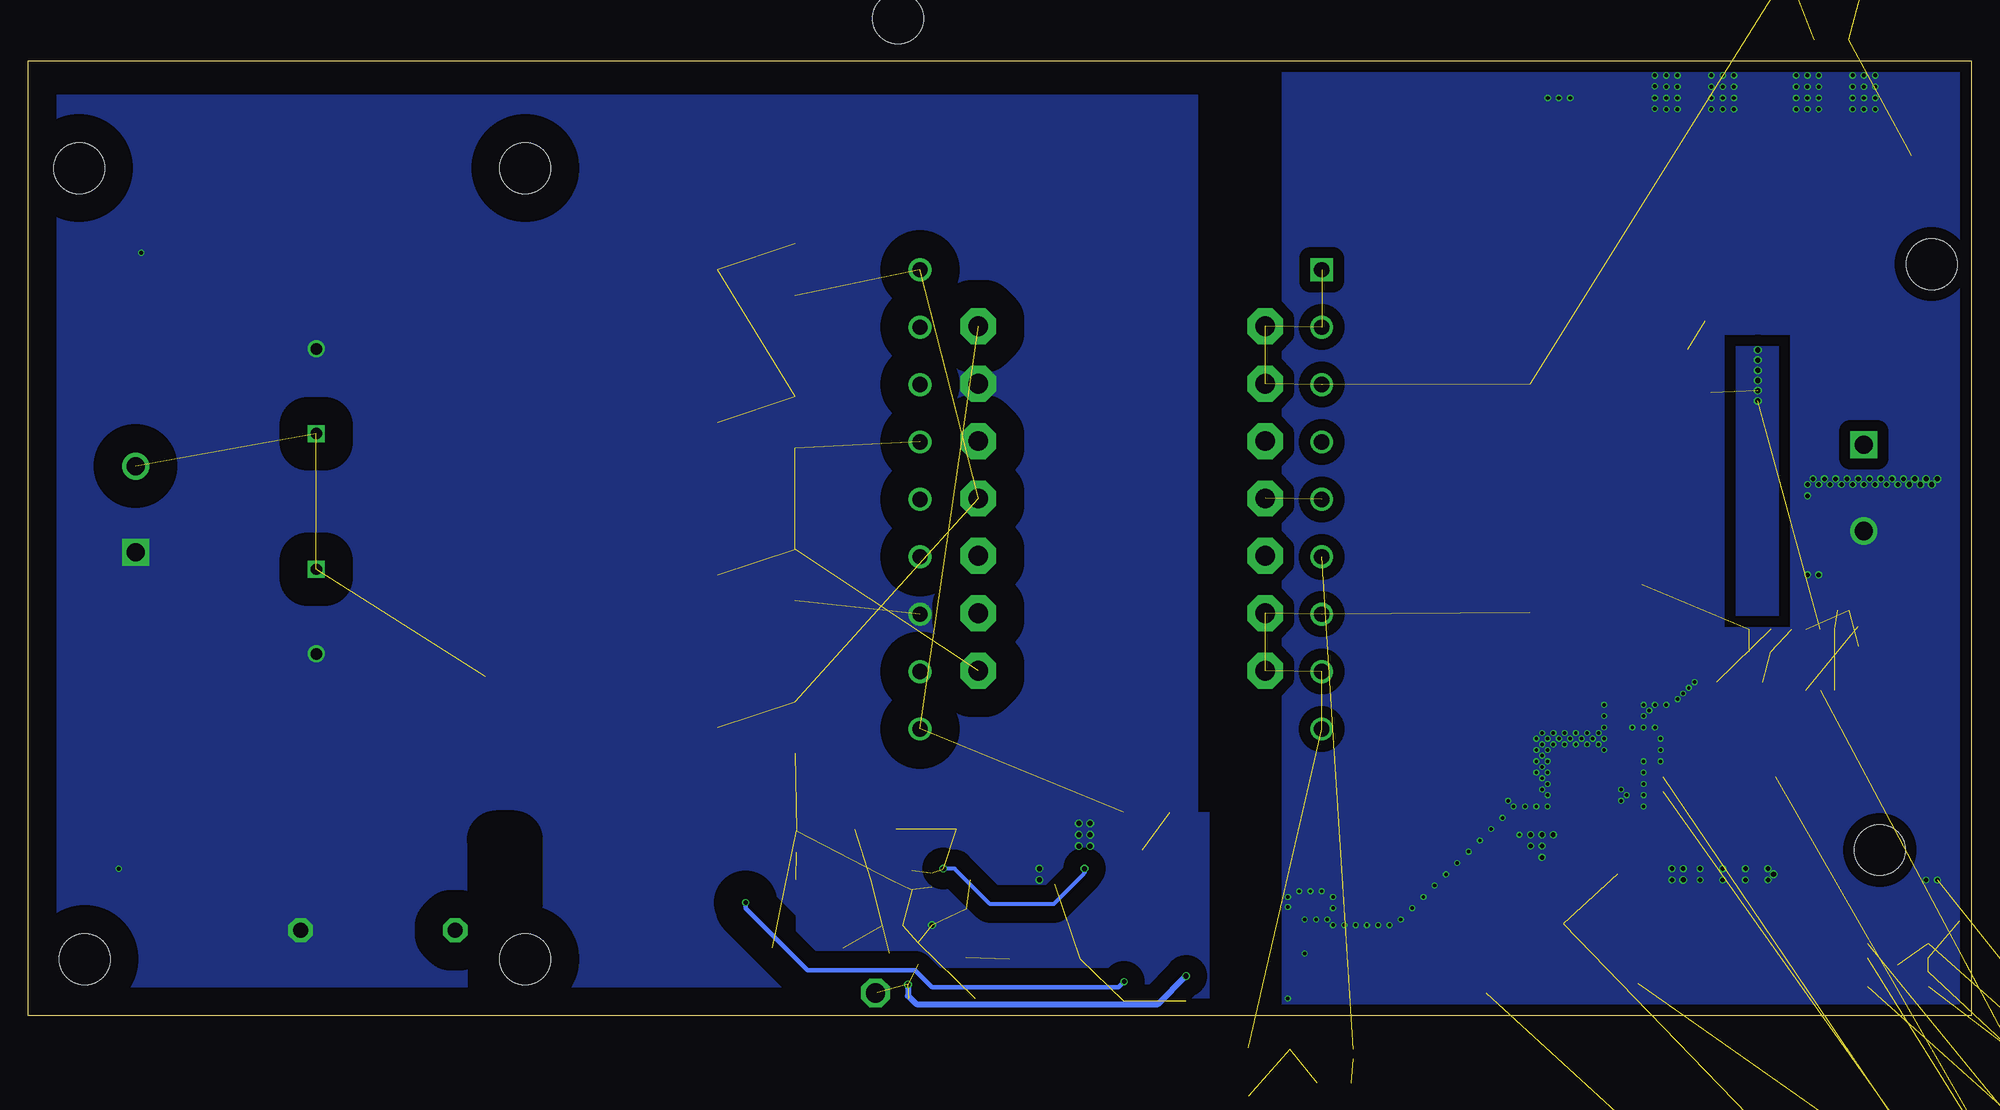
[diagram p7: board, bottom side, seen from below]

Size 172 x 84.5 mm. Coordinates in mm from the lower left corner, seen from the top.
Outline: 0,0 172,0 172,84.5 0,84.5 0,0
Copper layers (1*2*15*16): Top 0.035559375mm / dielectric 0.17018125mm / Route2 0.01778125mm / dielectric 47mil / Route15 0.01778125mm / dielectric 0.17018125mm / Bottom 0.035559375mm
Design rules "jlcpcb-4-layer": minimum track width 5mil, minimum drill 0.2mm, track to track 0.126490625mm, track to pad 0.126490625mm, pad to pad 0.126490625mm, via to via 0.126490625mm, smd to smd 0mil, copper to edge 0.1mm, drill to drill 5mil, minimum pad ring 4mil, minimum via ring 4mil, stop-mask expansion 3mil, vias tented up to drill 100mil, thermal gap 10mil
Holes 4.5 mm at 78.5,93 3.5,66.5 128,75 167.5,75 167,5 128,5 95,88.25 8.1,14.65
bRestrict: 3 lines

### Footprints (pad centres in the part's own frame; a part is rotated, then mirrored left to right if it is on the bottom)
CHIPLED_0805 = smd 1.2 x 1.2: A 0,-1.05; C 0,1.05
TP18R = smd 1.8 x 1.8: TP 0,0
P1-17 = drill 1.702 pad 2.54 octagon: TP 0,0
TP13R = smd 1.3 x 1.3: TP 0,0
16SVF1000M = smd 1.9 x 4.4: 1 0,-4.35; 2 0,4.35
C1206K = smd 1.5 x 2: 1 -1.5,0; 2 1.5,0
UD-8X10_NICHICON = smd 3.3 x 1.3: + 3.125,0; - -3.125,0
C0805K = smd 1.3 x 1.6: 1 -1,0; 2 1,0
CAPPRD750W80D1825H2700 = drill 1 pad 1.5 square: 1 0,0 | drill 1 pad 1.5: 2 7.5,0
C0603K = smd 1.05 x 1.08: 1 -0.875,0; 2 0.875,0
C0402 = smd 0.7 x 0.9: 1 -0.65,0; 2 0.65,0
C0402K = smd 0.925 x 0.74: 1 -0.6,0; 2 0.6,0
TO-252 = smd 3.048 x 1.524: 1 5.365,-2.286; 2 5.365,2.286 | smd 6.604 x 6.096: 3 -1.493,0
DIOM5127X229N = smd 2.2 x 1.55: 1 -2.05,0; 2 2.05,0
DIOM5336X265N = smd 2.284 x 2.124: 1 -2.164,0; 2 2.164,0
P1-13 = drill 1.321 pad 2.159 octagon: TP 0,0
SOIC127P600X175-8N = smd 1.5 x 0.65: 1 -2.7,1.905; 2 -2.7,0.635; 3 -2.7,-0.635; 4 -2.7,-1.905; 5 2.7,-1.905; 6 2.7,-0.635; 7 2.7,0.635; 8 2.7,1.905
SOT95P280X145-6N = smd 1.2 x 0.6: 1 -1.25,0.95; 2 -1.25,0; 3 -1.25,-0.95; 4 1.25,-0.95; 5 1.25,0; 6 1.25,0.95
SOIC127P600X170-9N = smd 1.525 x 0.65: 1 -2.712,1.905; 2 -2.712,0.635; 3 -2.712,-0.635; 4 -2.712,-1.905; 5 2.712,-1.905; 6 2.712,-0.635; 7 2.712,0.635; 8 2.712,1.905 | smd 2.4 x 3.1: 9 0,0
SOT95P280X145-3N = smd 1.2 x 0.6: 1 -1.25,0.95; 2 -1.25,-0.95; 3 1.25,0
DIPS3556W80P508L4960H3840Q18N = drill 1.35 pad 2.025 square: 1 0,0 | drill 1.35 pad 2.025: 2 0,-5.08; 3 0,-10.16; 4 0,-15.24; 5 0,-20.32; 6 0,-25.4; 7 0,-30.48; 8 0,-35.56; 9 0,-40.64; 10 35.56,-40.64; 11 35.56,-35.56; 12 35.56,-30.48; 13 35.56,-25.4; 14 35.56,-20.32; 15 35.56,-15.24; 16 35.56,-10.16; 17 35.56,-5.08; 18 35.56,0
TB00576202BE = drill 1.6 pad 2.4 square: 1 0,0 | drill 1.6 pad 2.4: 2 7.62,0
PSPMAA0605H-101M-IGF = smd 2.1 x 3.5: 1 0,0; 2 5.8,0
LQH5BPB100MT0L = smd 1.85 x 4.1: 1 -1.825,0; 2 1.825,0
B66362B1014T001 = drill 1.75 pad 3.175 octagon: 1 0,0; 2 0,25.4; 3 5.08,0; 4 5.08,25.4; 5 10.16,0; 6 10.16,25.4; 7 15.24,0; 8 15.24,25.4; 9 20.32,0; 10 20.32,25.4; 11 25.4,0; 12 25.4,25.4; 13 30.48,0; 14 30.48,25.4
SOP254P1015X230-4N = smd 1.85 x 0.7: 1 -4.7,1.27; 2 -4.7,-1.27; 3 4.7,-1.27; 4 4.7,1.27
D2PAK = smd 1.257 x 3.429: 1 -2.54,-8.192; 3 2.54,-8.192 | smd 10.668 x 9.017: 2 0,1.715
R2512 = smd 1.8 x 3.2: 1 -2.8,0; 2 2.8,0
R0805 = smd 1.3 x 1.5: 1 -0.95,0; 2 0.95,0
R0402 = smd 0.6 x 0.7: 1 -0.5,0; 2 0.5,0
R0603 = smd 1 x 1.1: 1 -0.85,0; 2 0.85,0
R1206 = smd 1.6 x 1.803: 1 -1.422,0; 2 1.422,0
DPACK = smd 1.6 x 3: 1 -2.28,-4.8; 3 2.28,-4.8 | smd 5.8 x 6.2: 4 0,2.38
DIOM5226X220N = smd 2.3 x 1.55: 1 -2.15,0; 2 2.15,0

### Placement (x,y rotation side)
5VLED  93,1.5 90 top
13.75V  44,2 270 top
13.75V_TP  42.5,5.5 270 top
AUX5V_TP  97,2 0 top
AUXBUCK_TP  92.5,16.5 270 top
C1  33,75.5 0 top
C2  43.5,75.5 0 top
C3  12.38,86.38 180 top
C4  82,5 0 top
C5  -31.5,-30 0 top  (outside the outline)
C6  146.5,51.5 90 top
C7  146.5,39.5 270 top
C8  5.3,77.1 90 top
C9  10,33.58 90 top
C10  8.5,33.5 90 top
C11  -32,-50 0 top  (outside the outline)
C12  22.5,75.5 0 top
C13  12,75.5 0 top
C14  36,14.5 0 top
C15  35.5,13 0 top
C16  30,24 180 top
C17  71.5,4 90 top
C18  75,5.38 0 top
C19  79,12.12 0 top
C20  83,14.62 0 top
C21  87.62,12 0 top
C22  92,12 90 top
C23  93.75,12 90 top
C24  95.5,8 0 top
C25  -32,-55 0 top  (outside the outline)
C26  -32,-60 0 top  (outside the outline)
C27  -40,-65 0 top  (outside the outline)
C28  -44,-75 0 top  (outside the outline)
C31  28.25,17 180 top
C32  96.5,12 0 top
C33  69.5,2.12 90 top
C34  103,6 180 top
C36  56.38,-6 180 top  (outside the outline)
D1  109.5,25.5 180 top
D2  109.5,66 180 top
D3  109.5,52.5 180 top
D4  109.5,39 180 top
D6  73,18 0 top
D7  80.5,17.5 180 top
D8  21.5,61.5 180 top
D9  20.5,29.5 180 top
D10  12.62,94.75 0 top  (outside the outline)
D11  64,-5 90 top
GATE1_TP  29.5,60.5 0 top
GATE2_TP  29,40 90 top
HVLED  164,15 180 top
HVOUT_TP  134.2,7.55 270 top
IC1  14,31.5 90 top
IC2  30,20.5 180 top
IC3  82.38,11.62 0 top
IC4  6.5,4.5 0 top
IC5  75,2.5 270 top
IC6  57.5,66 0 top
INPUT  9.5,50.5 270 top
J1  162.5,41 90 top
L1  -40.5,-58 0 top  (outside the outline)
L2  -37.5,-70 0 top  (outside the outline)
L3  88,16.5 0 top
L4  97,16.5 0 top
L5  62.5,61 270 top
OPT1  63,8.38 180 top
PWRGND_TP  147.9,7.55 0 top
Q1  37.38,55.88 270 top
Q2  37.38,35.62 270 top
R1  19.5,46.5 0 top
R2  24,55.1 0 top
R3  25.1,58 270 top
R4  11.32,35.88 180 top
R5  19.5,42.75 0 top
R6  19.5,39 0 top
R7  18.7,34.2 0 top
R8  18.7,32.2 0 top
R9  27.5,12.5 0 top
R10  30.5,12.5 0 top
R11  30.5,27.5 90 top
R12  35,16.5 90 top
R13  35.5,20 0 top
R14  35.5,22.5 0 top
R15  71.5,7 270 top
R16  73.38,13.25 270 top
R17  75.38,13.25 270 top
R18  79,10.62 0 top
R19  79.62,13.62 90 top
R20  85,10.88 270 top
R21  104,15.4 270 top
R22  105,12 0 top
R23  110,12 180 top
R24  118.5,12 180 top
R25  124.5,12 180 top
R26  133,12 180 top
R27  138.5,12 180 top
R28  144,12 180 top
R29  149.5,12 180 top
R30  155,12 180 top
R31  -32,-25 0 top  (outside the outline)
R32  -32,-35 0 top  (outside the outline)
R33  -32,-40 0 top  (outside the outline)
R34  47.2,2 180 top
R35  68,4.5 90 top
R36  89,1.5 0 top
R37  12.62,90.38 180 top  (outside the outline)
R38  57.5,-3 180 top
R39  -32,-45 0 top  (outside the outline)
R40  -44,-80 0 top  (outside the outline)
R41  -44,-85 0 top  (outside the outline)
U$1  HV  [PSFBC_ELECTRIC_SHOCK]  141.66,75.5 0 top
U$2  HV  [PSFBC_ELECTRIC_SHOCK]  164.9,59.86 90 top
U$3  155.1,26.85 90 top
U$4  157.43,7.5 0 top
VR1  33.75,8.12 270 top
VR2  94.5,5.5 0 top
Z3  89,7.25 90 top

### Tracks (layer width: path | path; a pad name or v marks a point on that pad's centre or on a via)
AUX1  (2 unrouted)
AUXB  (via drill 0.45)  (5 unrouted)
  Top 0.4: 92.14,12.65 C22.2
  Top 0.6: C19.1 78.4,10.72 R18.1
  Top 0.7: C19.1 78.4,12.9 v78.5,13 | v91,13 91.08,12.93
  Bottom 0.35: v78.5,13 78.5,12.6 81.23,9.86 86.86,9.86 90,13 v91,13
AUXBFILT  (4 unrouted)
AUXD  (1 unrouted)
  Top 0.6: R20.1 84.75,11.62 IC3.5
  Top 1: R16.2 R17.2 75.38,10.96 77.74,8.6 84.44,8.6
  pour Top (isolate 0.254, rank 3, no thermals): 83.5,4.5 87,4.5 87,11 86,12 83.5,12
BRIDGEGND
  Top 0.3: 26.59,33.09 25.09,34.59 23,34.59
  Top 0.4: R11.2 27.15,28.35 23,32.5 23,34.59
  pour Top (isolate 1.016, rank 2, no thermals): 31.1,54 21.12,54 21.12,31.5 31.1,31.5
BS2
  Top 0.6: IC3.1 81.03,13.53 C20.1
CS-IN
  Top 0.4: IC2.3 32.37,21.14 31,22.5 31,23.88 C16.1 30.88,26.27 R11.1
DC+  (3 unrouted)
  Top 0.4: HVOUT_TP.TP 131.58,10.17 R26.2 131.5,12 | 131.5,12 131.5,22 | R25.1 131.5,12
  Top 0.406: 131.5,22 131.5,30
DRAIN1  (6 unrouted)
DRAIN2  (6 unrouted)
EN2
  Top 0.6: IC3.4 83.97,10.38 R20.2
FB2
  Top 0.6: IC3.3 79.55,10.68 R18.2 79.5,12.03 C19.2 79.62,12.15 R19.1
GND  (4 unrouted)
GNDA  (via drill 0.3, 0.35, 0.4, 0.45)  (3 unrouted)
  Top 0.8: C31.1 29.12,18.38 v29,18.5
  Top 0.813: R9.1 26,12.5 v25.5,12
  other vias: 17.5,12.5 15.5,83.2 13.5,83.2 13.5,80.2 13.5,81.2 13.5,82.2 10.5,82.2 10.5,81.2 10.5,80.2 10.5,83.2 9.5,83.2 9.5,80.2 9.5,81.2 9.5,82.2 8.5,82.2 8.5,81.2 8.5,80.2 8.5,83.2 14.5,83.2 14.5,80.2 14.5,81.2 14.5,82.2 15.5,82.2 15.5,81.2 15.5,80.2 28,83.2 26,83.2 26,80.2 26,81.2 26,82.2 23,82.2 23,81.2 23,80.2 23,83.2 22,83.2 22,80.2 22,81.2 22,82.2 21,82.2 21,81.2 21,80.2 21,83.2 27,83.2 36.5,81.2 27,81.2 27,82.2 28,81.2 35.5,81.2 27,80.2 59.5,11 56.5,10.5 58.5,11 60.5,9.6 59,5.5 60.5,10.5 57.5,11 28,80.25 28,82.25 37.5,81.2 5.5,47 32.5,24.5 33.5,24.5 34.5,24.5 35.5,24.5 36.5,24.5 36,25 37,25 38.5,23.5 37.5,24.5 38.5,24.5 40,16 30,25.5 29,25.5 29,26.5 29,27.5 28,27.5 27,27.5 26,28 25.5,28.5 25,29 24.5,29.5 28.5,27 29,22.5 27.5,24.5 29,21.5 29,20.5 29,19.5 32.5,23.5 33,24 34,24 35,24 36,24 37,24 38,24 38.5,21.5 38.5,22.5 35,25 34,25 33,25 38,25 3,12 4,12 18,13 18,12 20,13 20,12 22,13 22,12 24,13 24,12 26.5,13 26.5,12 25.5,13 37,16 38,16 38,15 39,16 38,14 39,15 43.5,15.5 44.5,14.5 45.5,13.5 46.5,12.5 47.5,11.5 48.5,10.5 49.5,9.5 50.5,8.5 51.5,8 52.5,8 53.5,8 54.5,8 55.5,8 56.5,8 56.5,9.5 58,8.5 59,8.5 57,8.5 42.5,16.5 41.5,17.5 40.5,18.5 39.5,18.5 38.5,18.5 37.5,18.5 37.5,19.5 37.5,20.5 37.5,21.5 37.5,22.5 37.5,23.5 32.5,25.5 32.5,26.5 32.5,27.5 28,25.5 27.5,22.5 27.5,23.5 31,20 31,19 30.5,19.5 38,23 38,22 38,21 38,20 41,19 60.5,1.5 14.5,47 13.5,47 14.5,46 14.5,39 13.5,39 14,47.5 13,47.5 12.5,47 12,47.5 11.5,47 11,47.5 10.5,47 10,47.5 9.5,47 9,47.5 8.5,47 8,47.5 7.5,47 7,47.5 6.5,47 6,47.5 5,47.5 4.5,47 4,47.5 3.5,47 3,47.5
  pour Bottom (isolate 1, rank 6, no thermals): -20,88.05 61,88.05 61,-2.5 -20,-2.5
  pour Top (isolate 1.016, rank 6, no thermals): 49.5,86 -3.5,86 -3.5,77.5 49.5,77.5
  pour Top (isolate 0.4, rank 6, no thermals): 60.99,-0.5 60.99,20.5 50,20.5 45,25.5 31,25.5 31,18 35,18 35,9 44,9 44,-0.5
  pour Top (isolate 1.016, no thermals): 18,48 1.5,48 1.5,33.5 10.5,33.5 10.5,37 18,37
  pour Route15 (isolate 0.2, no thermals): 60.5,87 -26,87 -26,-10.5 60.5,-10.5
  pour Top (isolate 0.2, no thermals): 33,28 26.5,28 24.5,30 24,30 24,28.5 16.5,28.5 16.5,22.5 17.5,21.5 27.5,21.5 27.5,18 33,18
  pour Top (isolate 0.4, no thermals): 11.5,11.5 27.12,11.5 27.12,13.5 7.5,13.5 6.5,12.5 6.5,39 2.5,35 2.5,9 3,8.5 9.5,8.5 9.5,9.5
N$1
  Top 0.61: R25.2 R24.1
N$2  (1 unrouted)
N$3  (via drill 0.4)
  Top 0.35: C17.1 73.38,3.12 74.12,3.88
  Top 0.4: R22.2 105.5,12 | IC5.2 74.05,5.3 C18.1 74.12,3.88 v75,3 | v108.5,10 108.5,11.92 R23.2
  Top 0.61: R23.2 R22.2
  Bottom 0.4: v75,3 75.5,2.5 92,2.5 93.5,4 103,4 108.5,9.5 v108.5,10
N$4  (1 unrouted)
N$5  (1 unrouted)
  Top 0.4: IC1.4 15.9,22.59 17.36,21.14
N$6  (2 unrouted)
N$7  (via drill 0.45)  (2 unrouted)
  other vias: 18.9,57.1 18.9,54.4 18.9,55.3 18.9,58.9 18.9,56.2 18.9,58
  pour Bottom (isolate 1.016): 17.1,59.25 17.1,35.38 20.8,35.38 20.8,59.25
  pour Top (no thermals): 20.75,54 18.25,54 18.25,62.3 20.75,62.3
N$8  (2 unrouted)
N$9  (1 unrouted)
N$10
  Top 0.813: R9.2 29,12.5 | 29,12.5 R10.1 | VR1.1 29,10.4 29,12.5
N$11  (1 unrouted)
N$12
  Top 0.61: R30.1 157.92,12 161.97,16.05 HVLED.A
N$13
  Top 0.4: IC2.2 34.52,19.86 R13.1
N$14
  Top 0.61: R29.1 R30.2
N$15
  Top 0.61: R24.2 R23.1
N$16  (1 unrouted)
N$17
  Top 0.61: R28.1 R29.2
N$18
  Top 0.4: 75.95,5.05 75.62,5.38 C18.2 75.88,5.97 75.95,6.05 74.15,7.85 R15.1 70.65,7.85 68.86,9.64 OPT1.2
  Top 0.7: IC5.1 75.95,5.05
N$19
  Top 0.35: OPT1.1 68,7.11 R35.2
N$20  (2 unrouted)
N$21
  Top 0.4: R15.2 C17.2
N$22
  Top 0.406: 13.75V.C R34.2
N$23  (2 unrouted)
N$24
  Top 0.61: R27.1 R28.2
N$25  (1 unrouted)
N$26
  Top 0.8: R36.2 89.9,1.55 89.95,1.5 5VLED.C
N$27  (1 unrouted)
  Top 1: R17.1 R16.1 73.95,14.67
N$28
  Top 0.61: R26.1 R27.2
N$29  (3 unrouted)
N$30  (3 unrouted)
N$31  (3 unrouted)
N$32  (2 unrouted)
N$33  (1 unrouted)
N$34  (1 unrouted)
OPTO-EMITT
  Top 0.4: OPT1.4 50.4,7.11 40.15,17.35 R12.2 33.76,18.59 IC2.1
PRE  (4 unrouted)
  Top 0.813: VR1.3 28.95,3 29.5,3 29.5,2.88
  pour Top (isolate 1.016, rank 3, no thermals): 18.5,0 30.75,0 30.75,8.37 18.5,8.37
PWRGND  (via drill 0.35, 0.45)  (15 unrouted)
  Top 0.152: HVLED.C v164,13
  Top 0.6: IC3.2 82.12,11.62 v82.5,12
  Top 0.7: v82.5,12 v82.5,13
  other vias: 79,15 78,15 79,17 78,16 78,17 79,16 162,67.5 92,8
  pour Bottom (isolate 2.5, rank 6, no thermals): 185,81.5 68.5,81.5 68.5,-4.5 182,-4.5 186,-0.5 186,80.5
  pour Bottom (isolate 1.5, no thermals): 104,18 67.5,18 67.5,1 104,1
  pour Top (no thermals): 77.5,14 80,14 80,18.5 77.5,18.5
Q1G
  Top 0.813: R3.2 25.1,55.25 R2.2
  pour Top (rank 3, no thermals): 31,62.5 22,62.5 22,54.5 31,54.5
Q2G  (2 unrouted)
  pour Top (no thermals): 27.4,37.1 30.8,37.1 30.8,41 27.4,41
RECT  (3 unrouted)
REG  (3 unrouted)
  Top 0.6: 42.3,5.3 13.75V_TP.TP
  Top 0.8: 13.75V_TP.TP 43,5.5 | 25.5,17 25,17 25,18.5 25.09,18.59 IC2.8 27.3,17.5 | 25.5,17 C31.2 27.3,17.07 27.3,17.5 | 25.5,17 25.5,18 26.8,18 27.3,17.5
  pour Top (isolate 0.4, rank 5, no thermals): 43.5,12 31,12 31,7 31.5,7 31.5,-1.5 43.5,-1.5
  pour Top (isolate 0.6, no thermals): 35,17.5 16.5,17.5 11,23 11,33 8,33 8,15 8.5,14.5 28,14.5 31,11.5 31,7.5 34.5,7.5 34.5,10.5 35,11
REG5V  (via drill 0.45)  (3 unrouted)
  Top 0.4: C33.2 v69.5,3.5
  Top 0.55: AUX5V_TP.TP 96.88,2
  Top 1: v69.5,3.5 68.15,3.5 R35.1
  Bottom 0.55: v94.12,2.75 94.12,1.75 93.38,1 72,1 v69.5,3.5
RT
  Top 0.4: IC2.4 34.55,22.41 R14.1
SWITCH2
  pour Top (isolate 0.305, rank 2, no thermals): 83.5,12.5 84,12.5 84.5,13 86,13 87,14 87,19 81.5,19 81.5,16 83.5,16
TRANS1  (4 unrouted)
TRANS2  (4 unrouted)
VCCIN  (8 unrouted)
  Top 0.6: 1,8.38 1,50.5 INPUT.1
  Top 2: 54.7,-3.83 R38.2
  pour Top (isolate 1.016, rank 3, no thermals): 49.5,63 18,63 18,48.38 -4,48.38 -4,76.5 49.5,76.5
  pour Route2 (isolate 0.2, no thermals): 60.5,87 -31.5,87 -31.5,-16.5 60.5,-16.5

### Text on the board
tNames: +VBATT | ABS MAX 35V IN | HV OUT | GND | GND_HV | *** WARNING / HV PRESENT ***